# EAGLE schematic schematic_final_pcb (EAGLE 9.7.0)
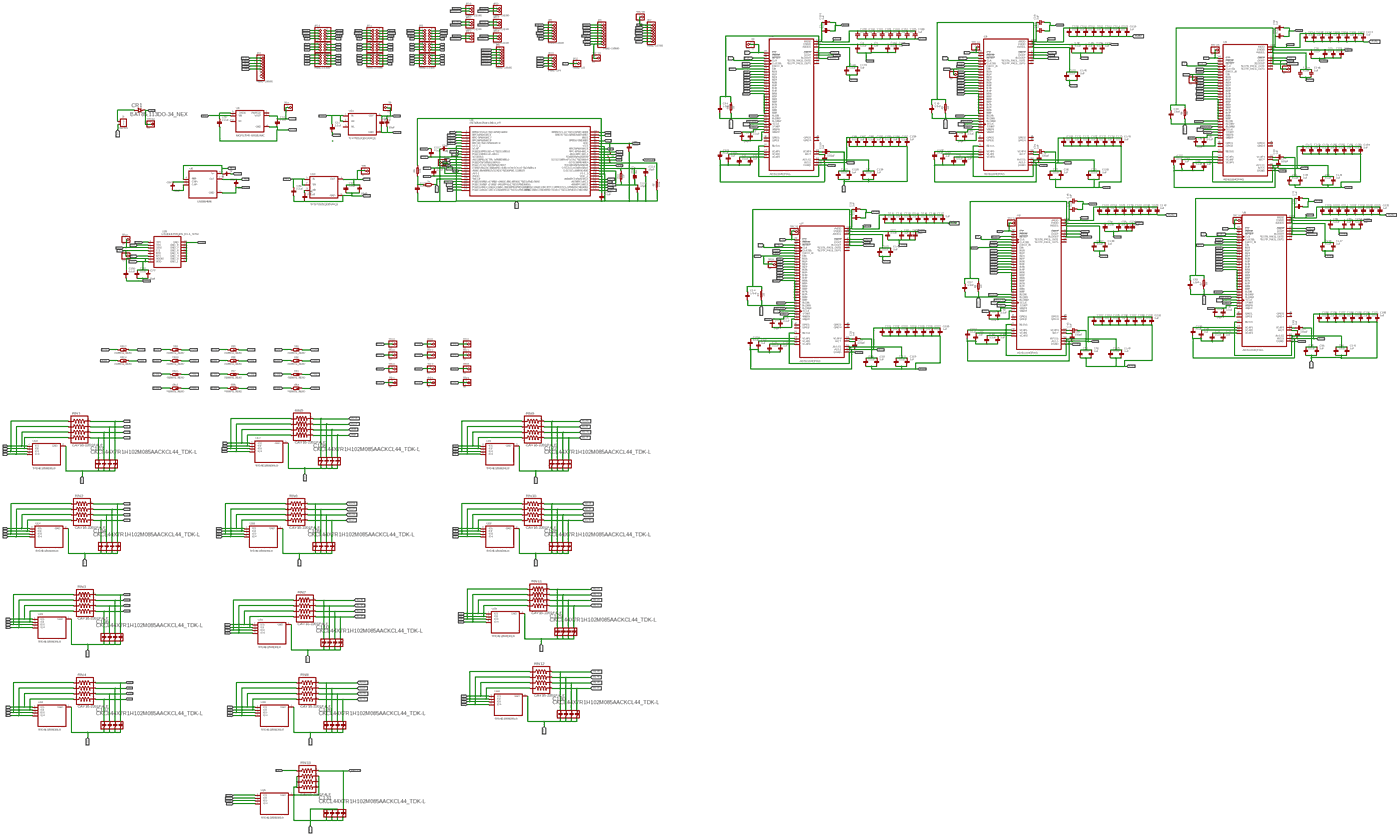
[diagram p0: schematic, sheet 1, overview]
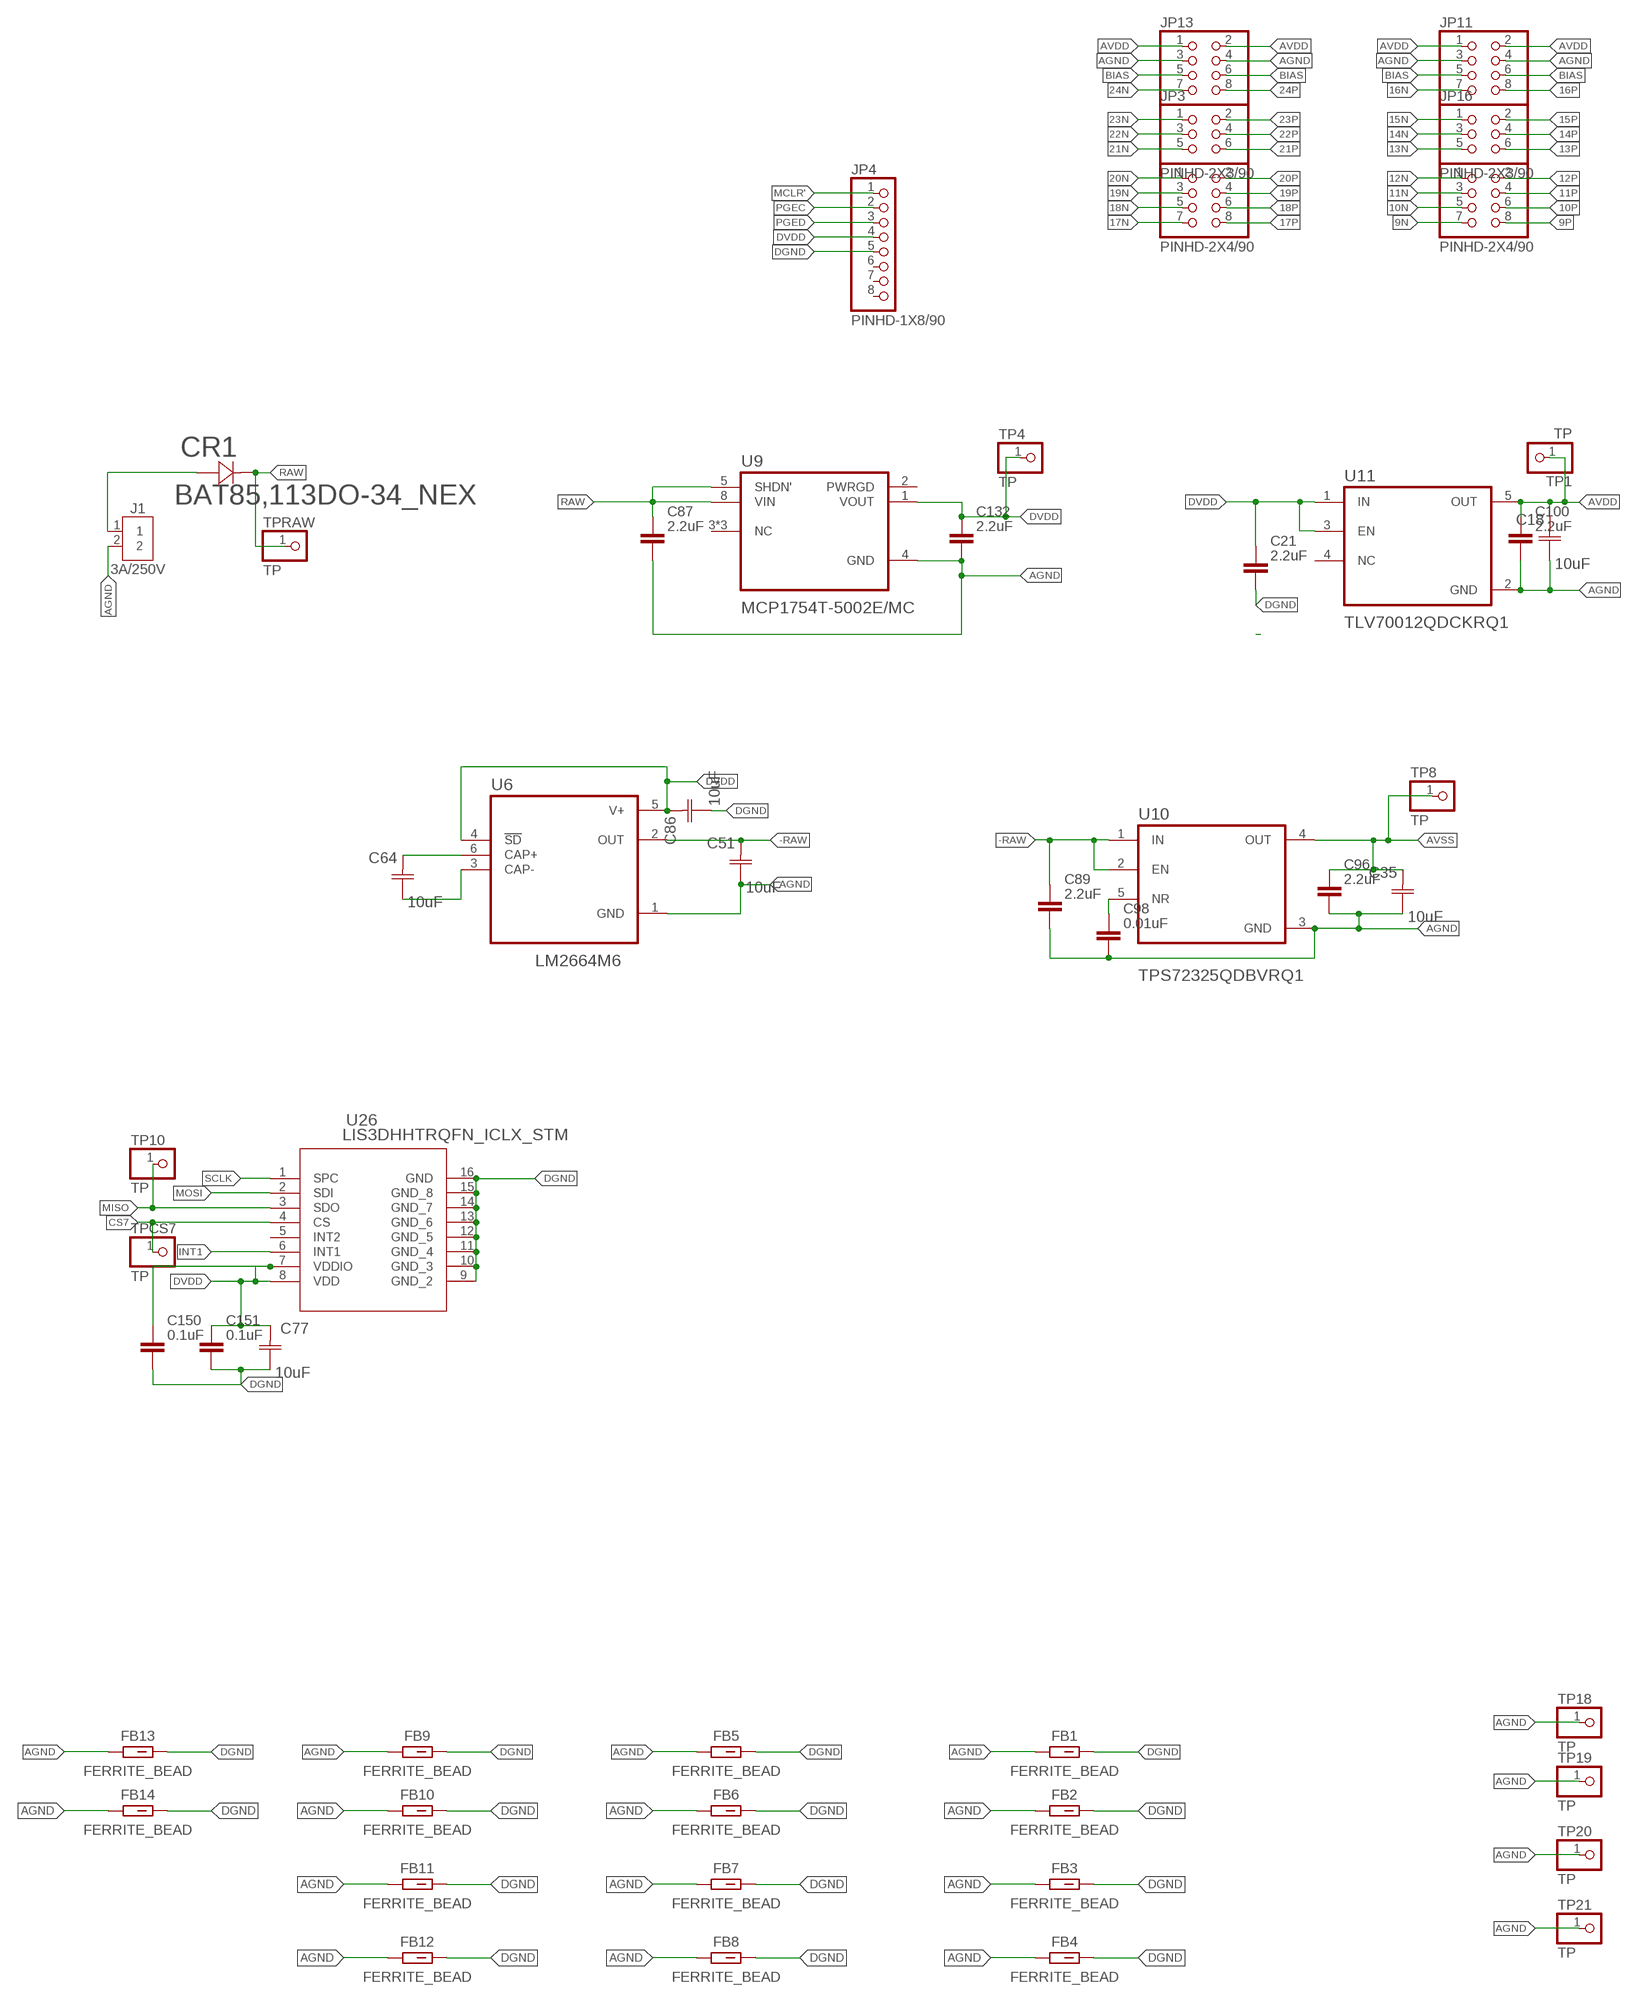
[diagram p1: schematic, sheet 1, part 1 of 6]
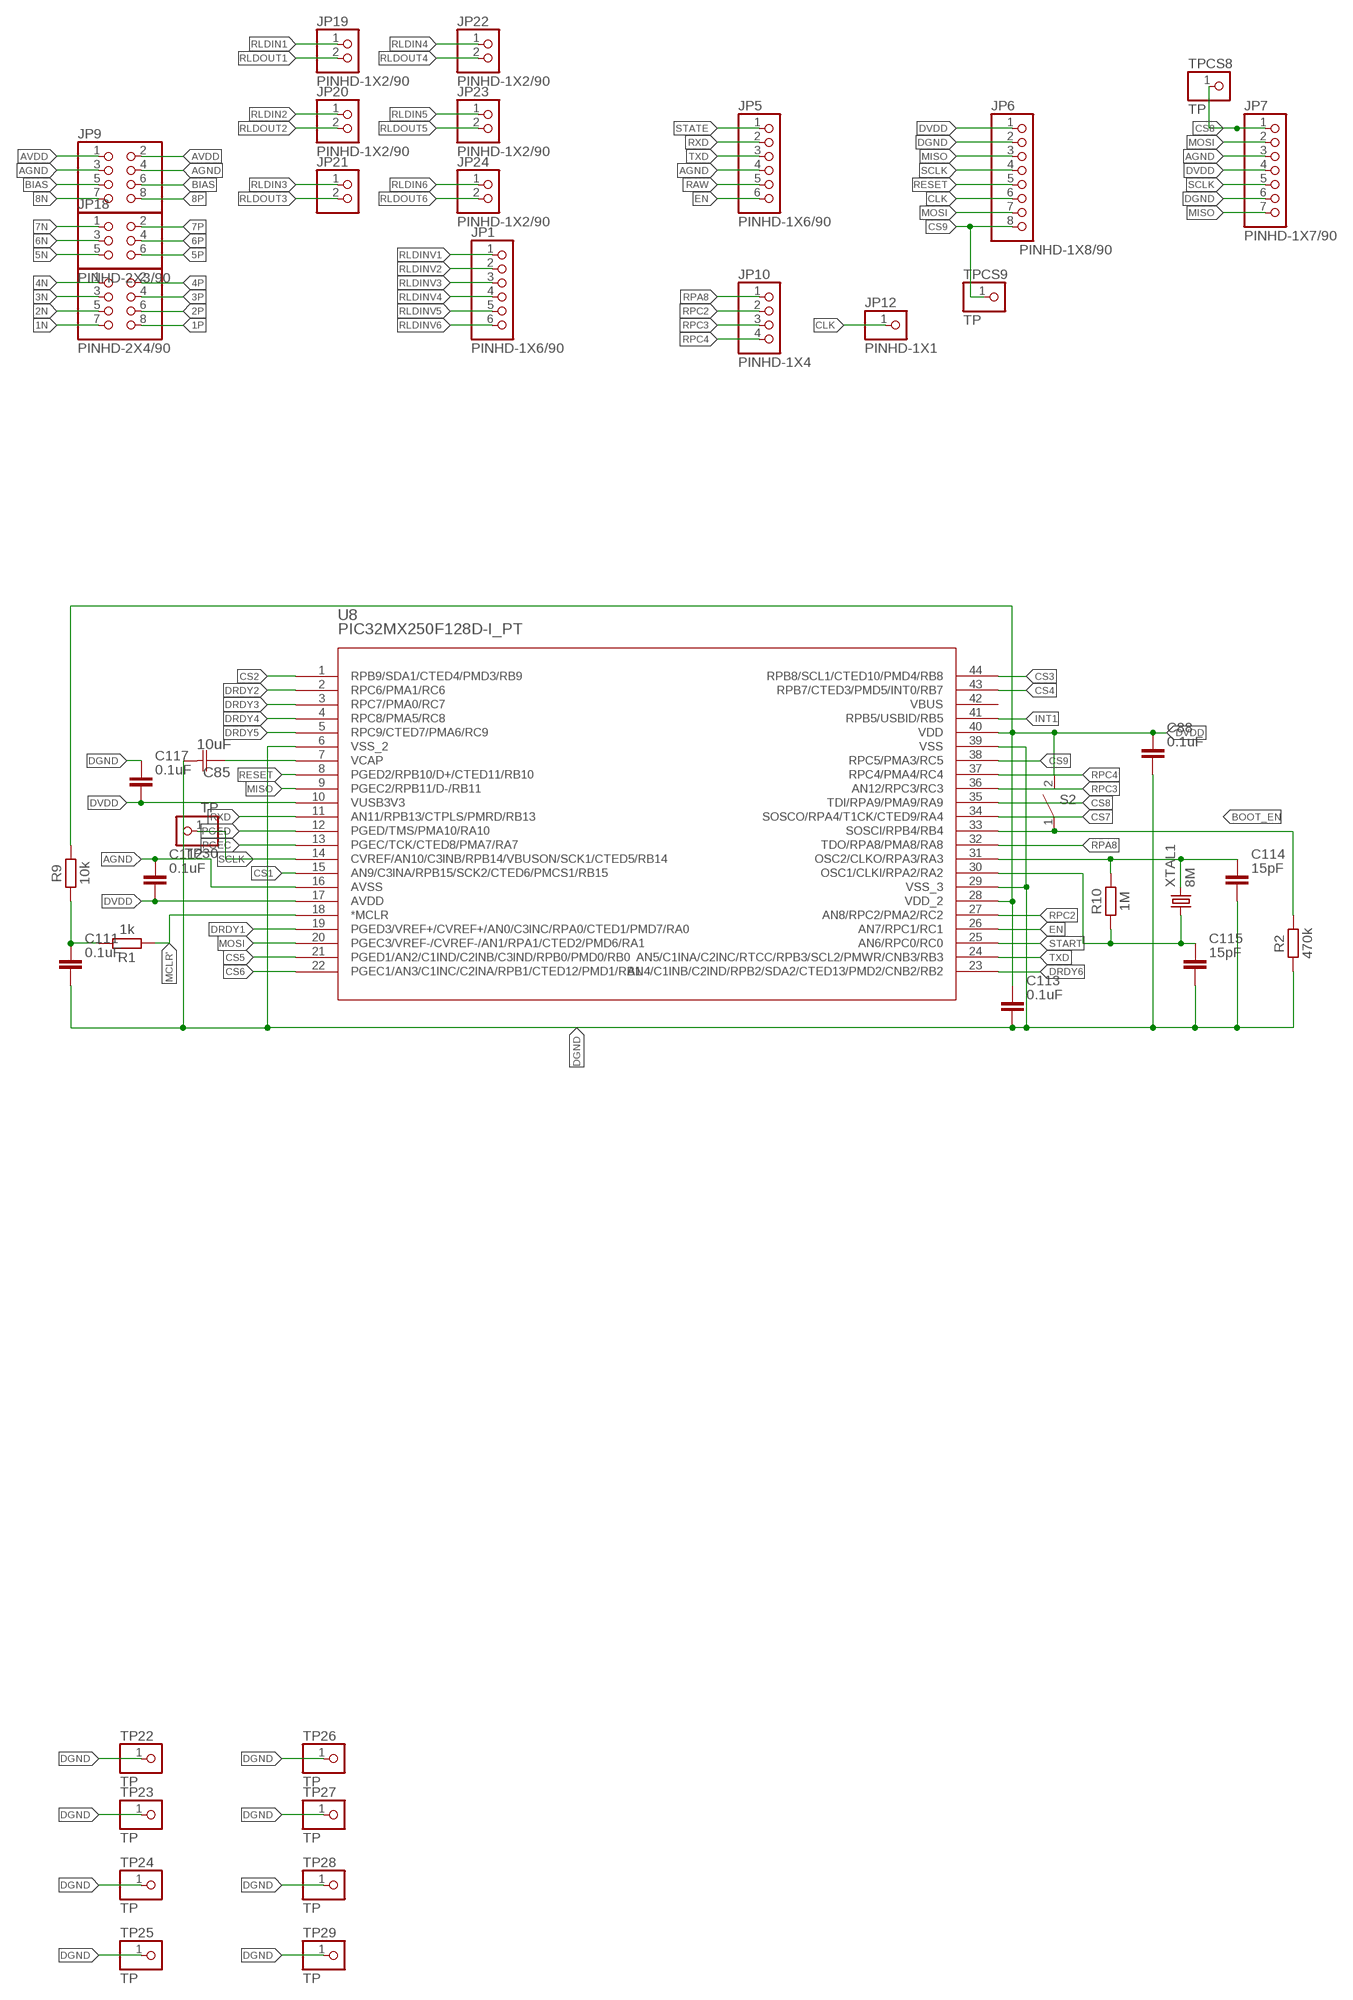
[diagram p2: schematic, sheet 1, part 2 of 6]
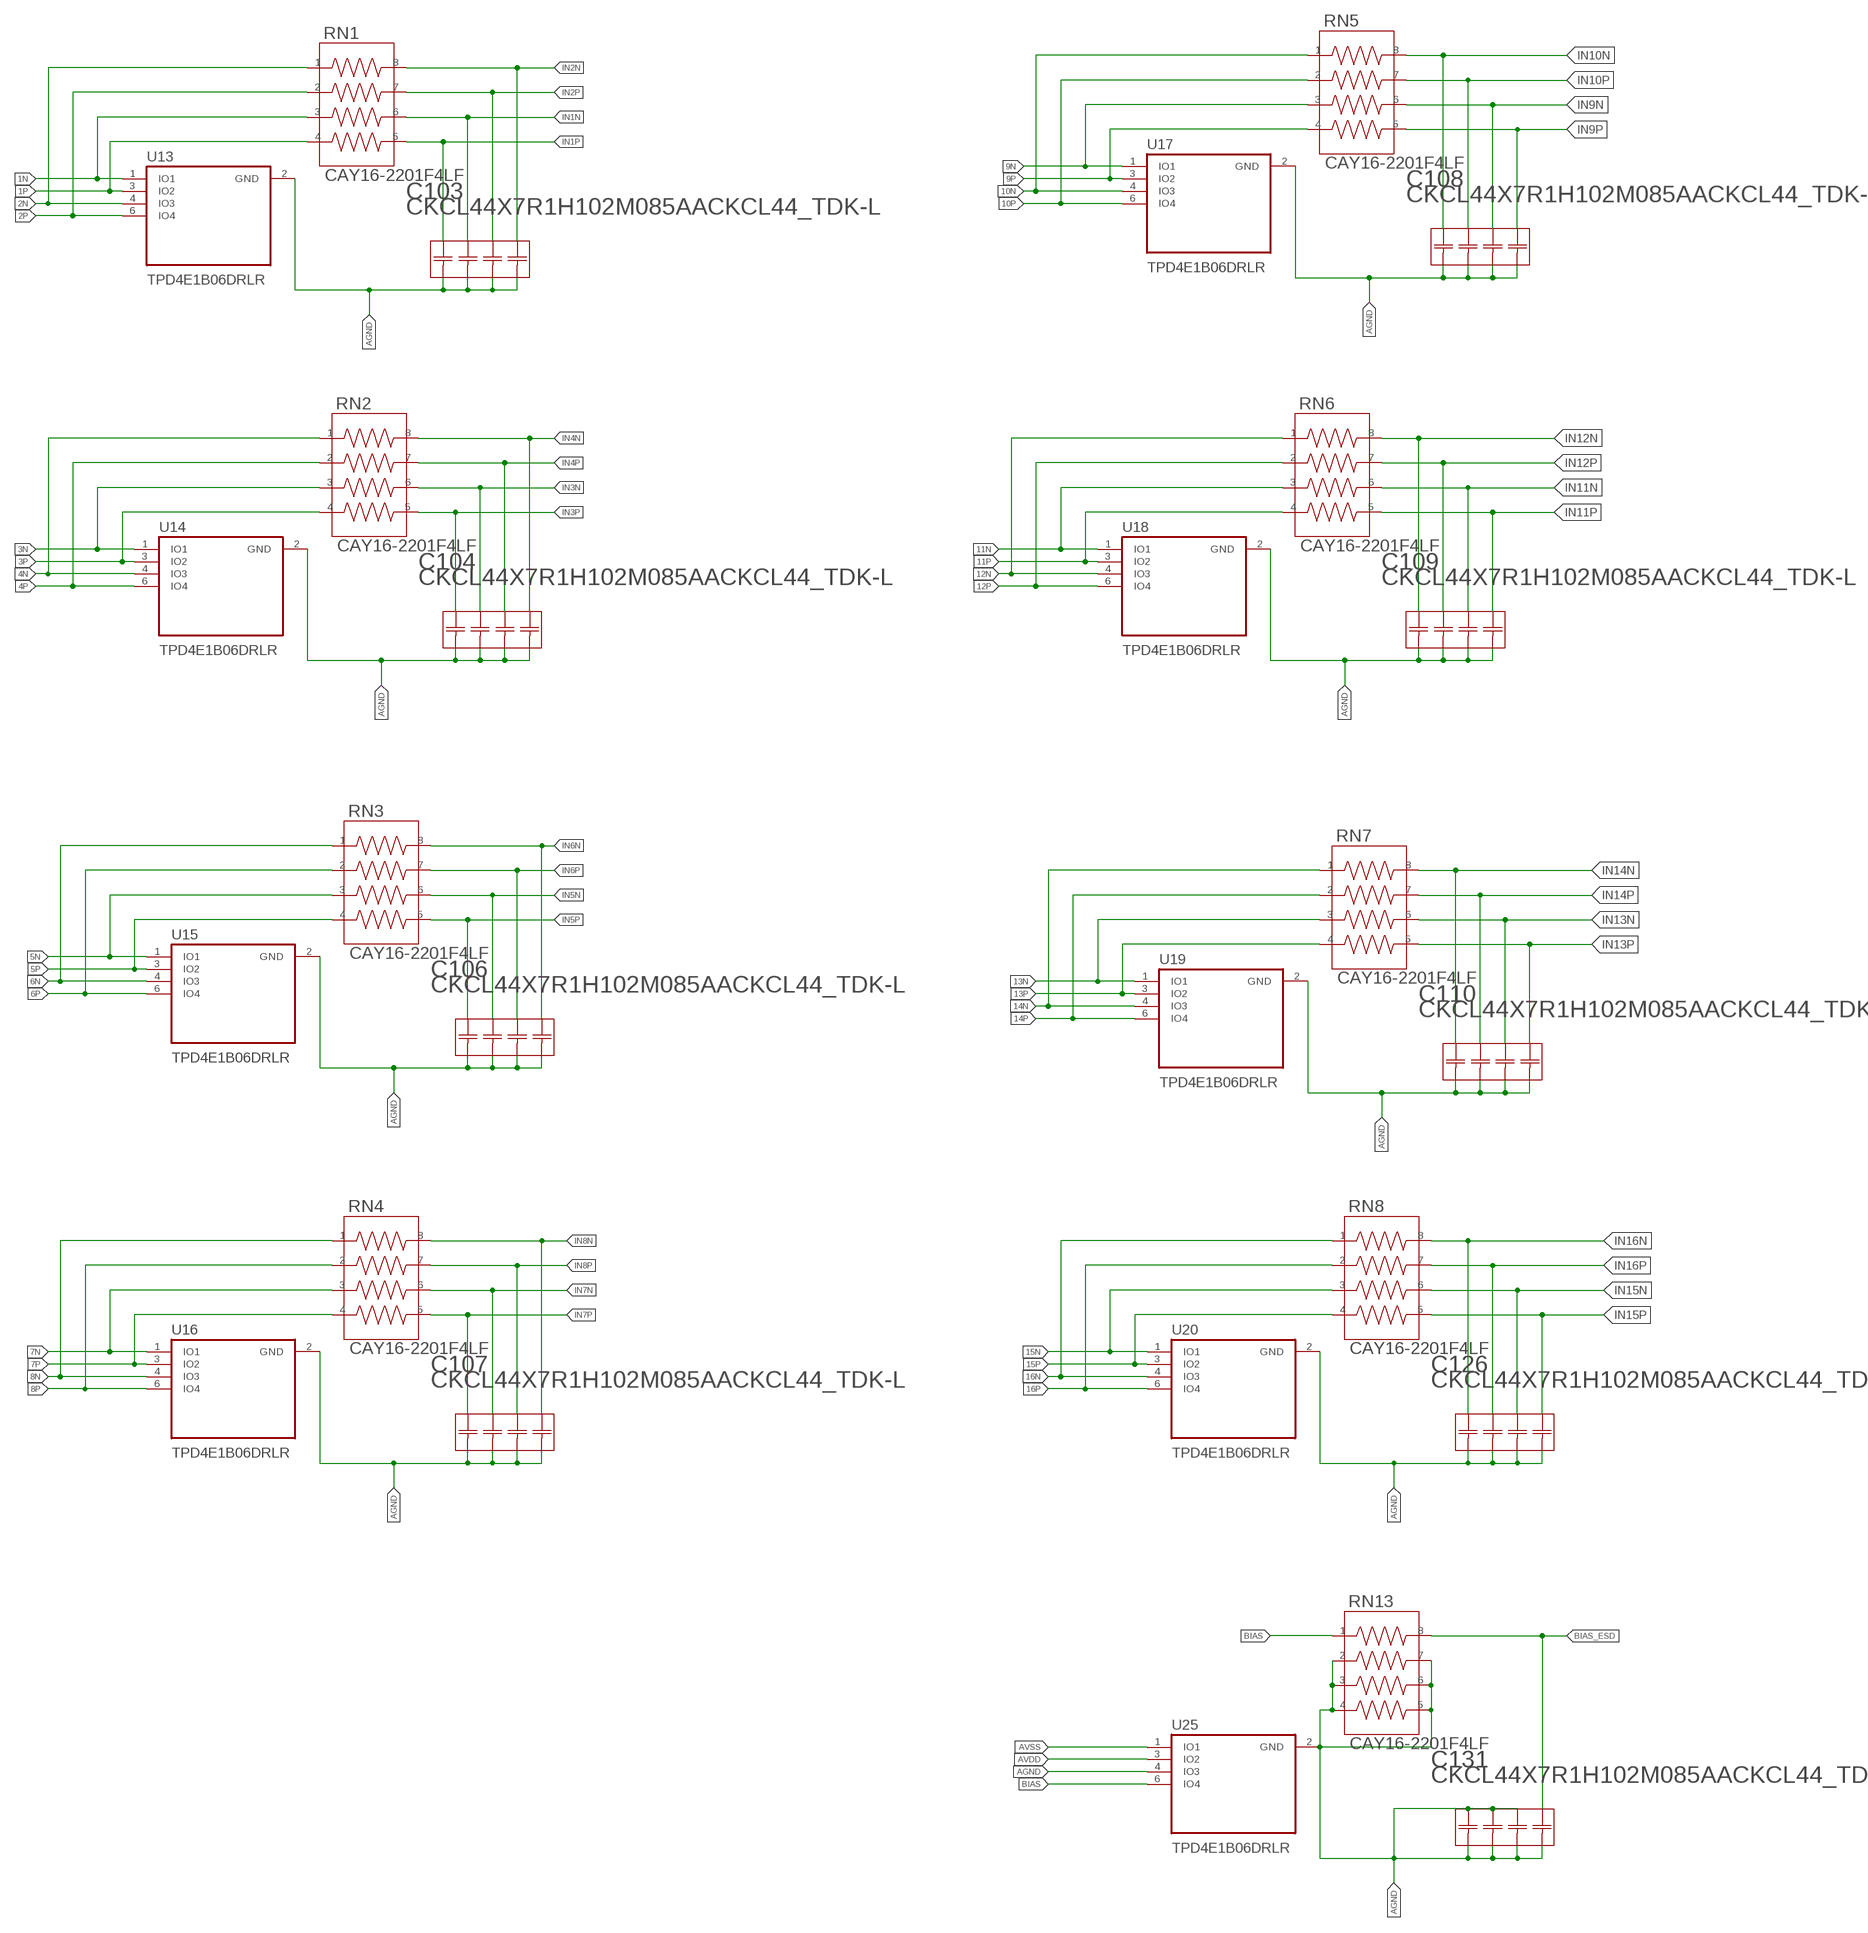
[diagram p3: schematic, sheet 1, part 3 of 6]
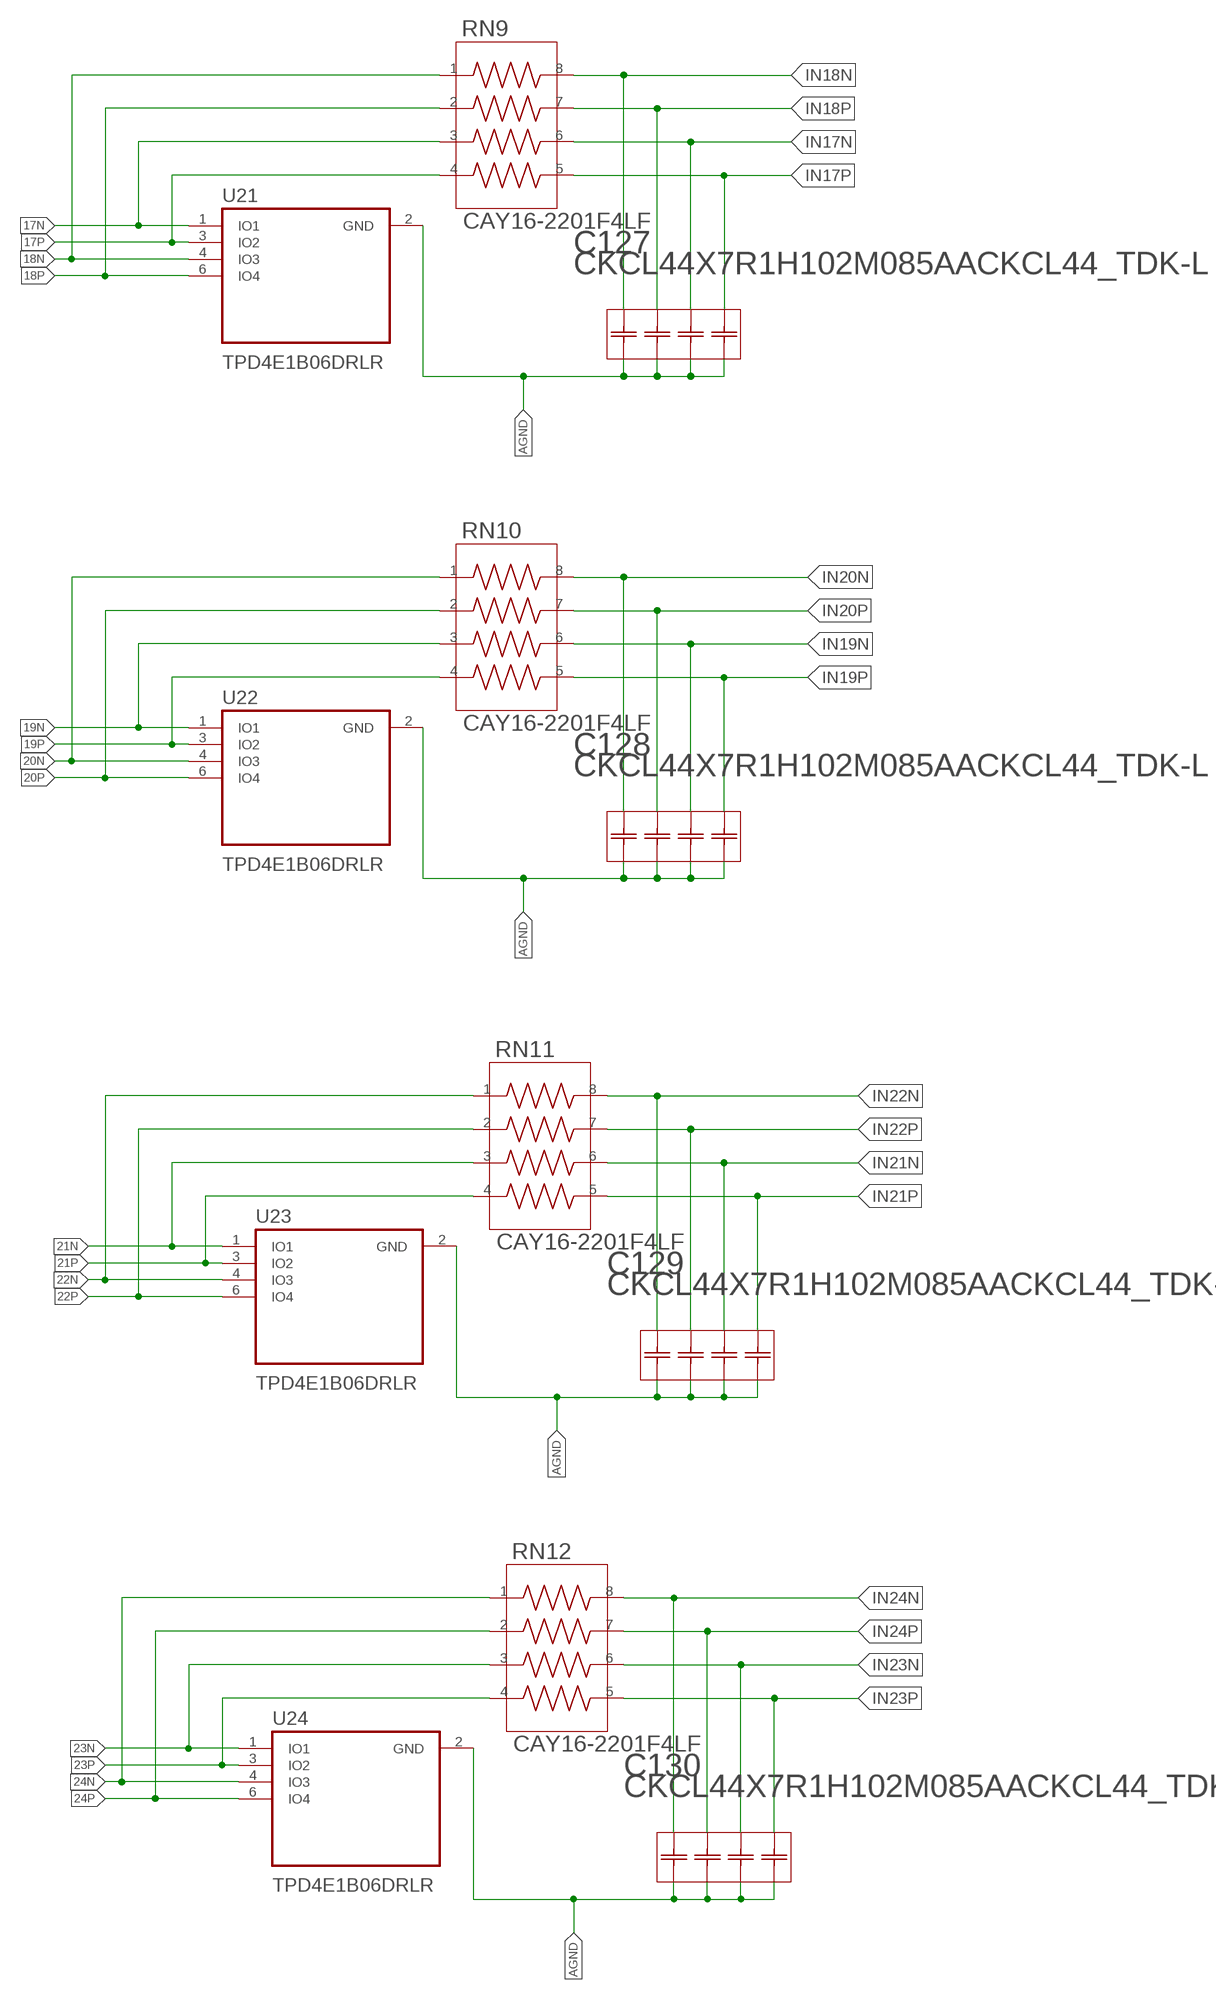
[diagram p4: schematic, sheet 1, part 4 of 6]
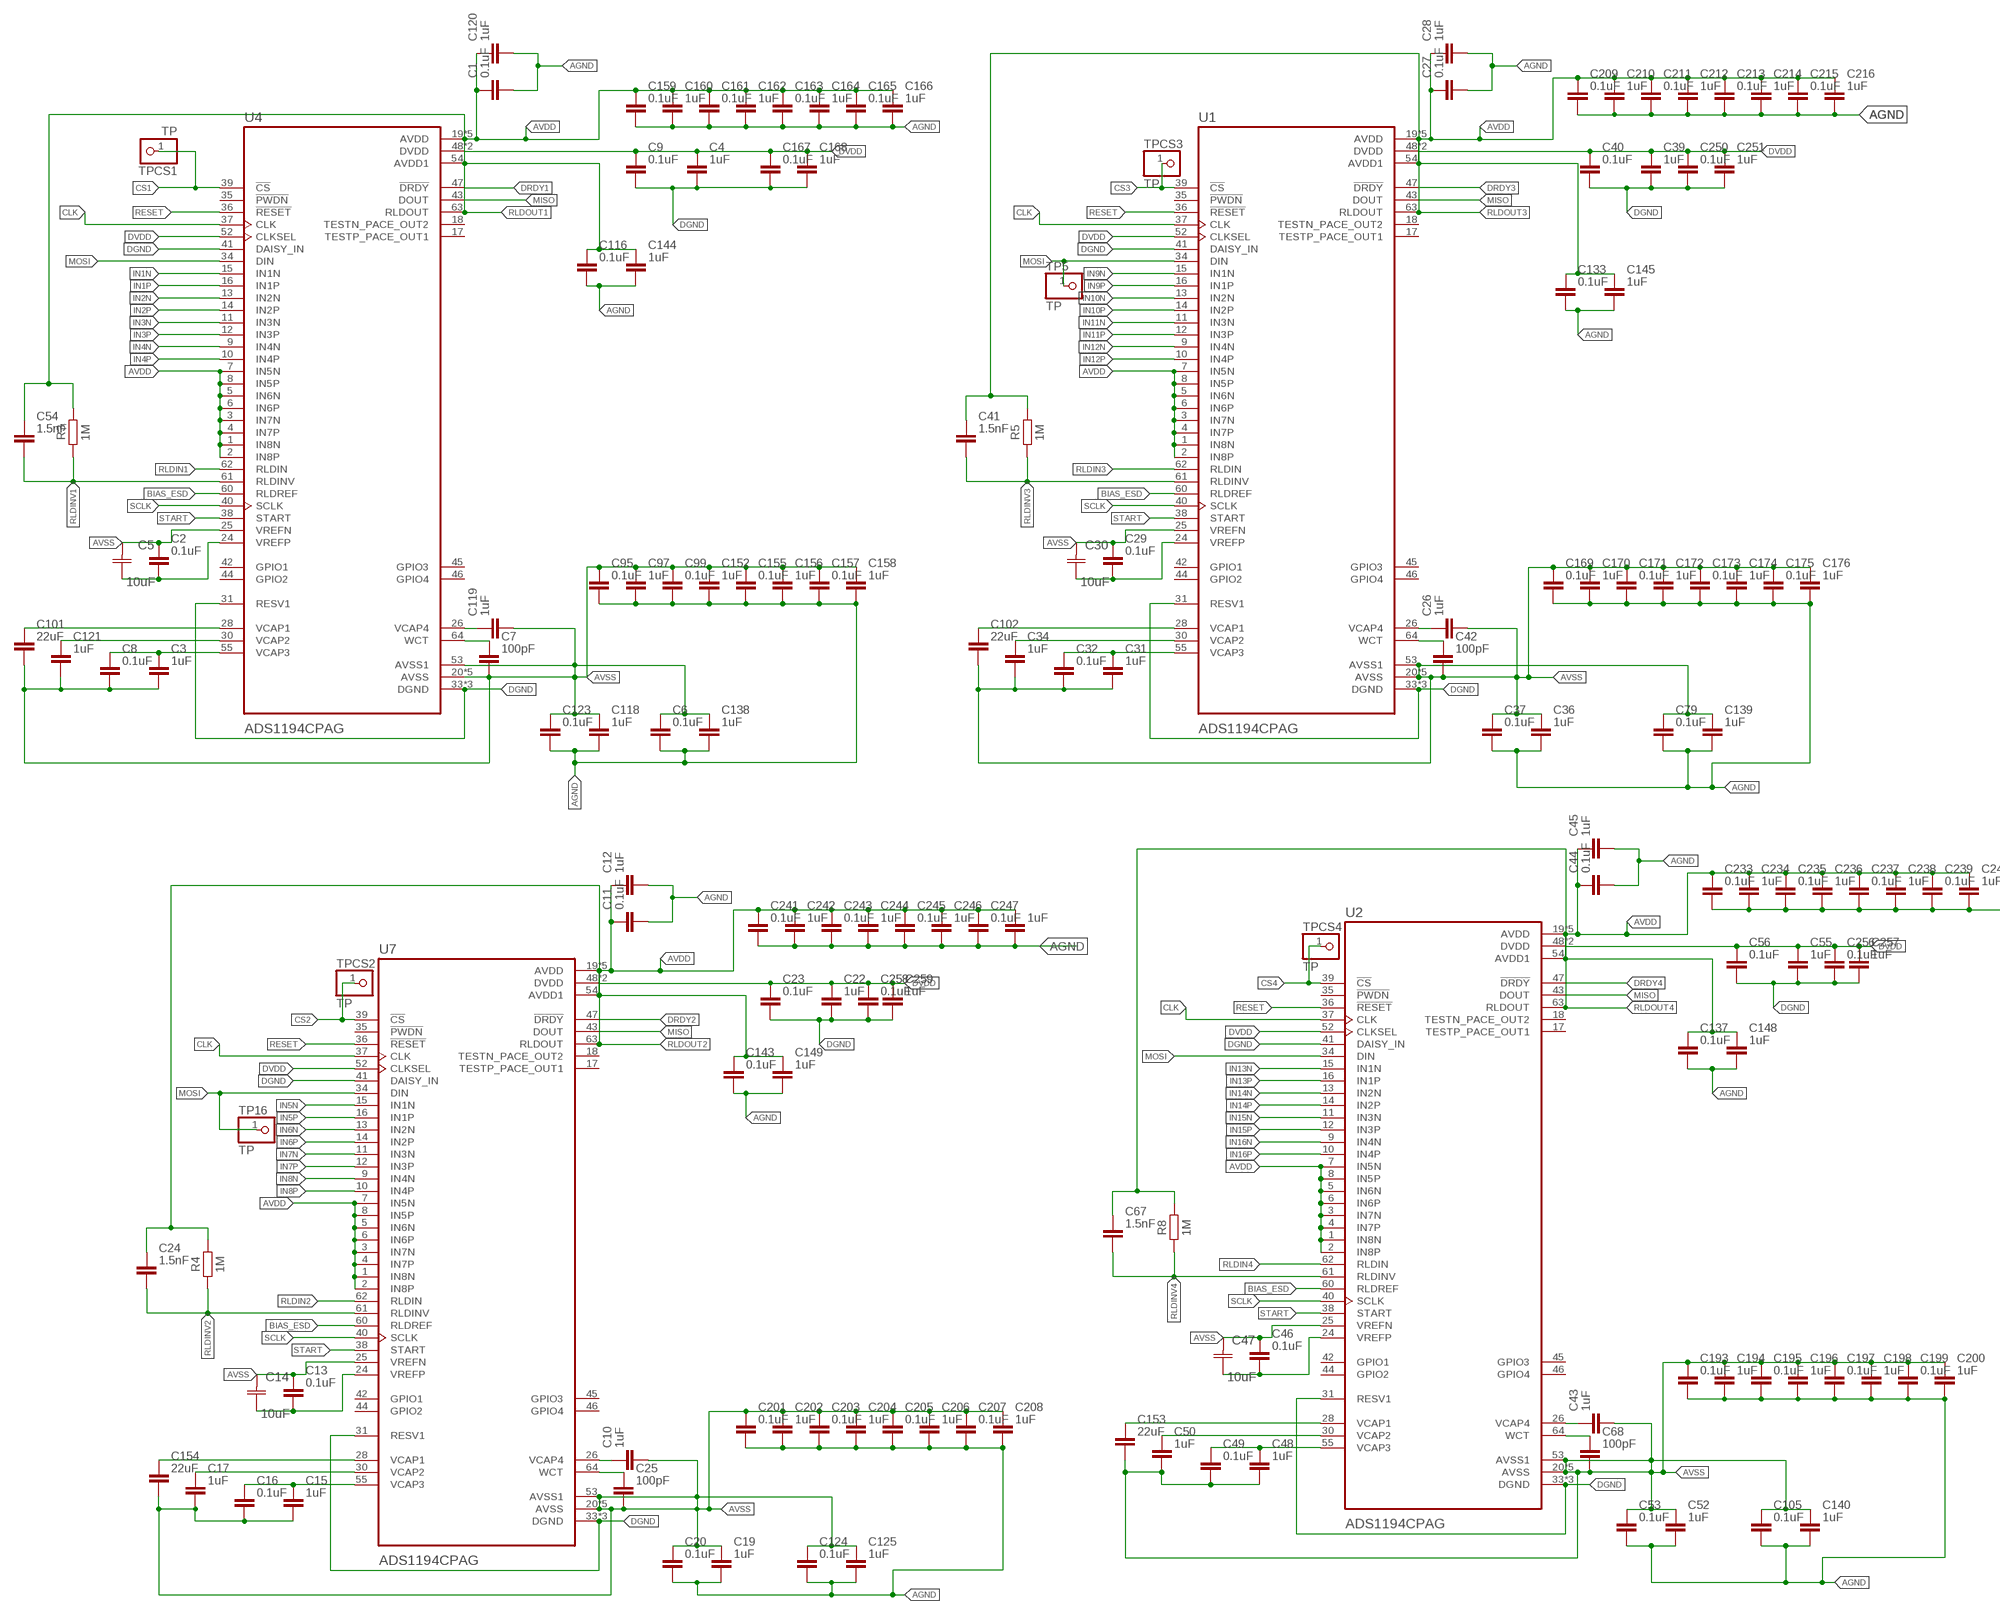
[diagram p5: schematic, sheet 1, part 5 of 6]
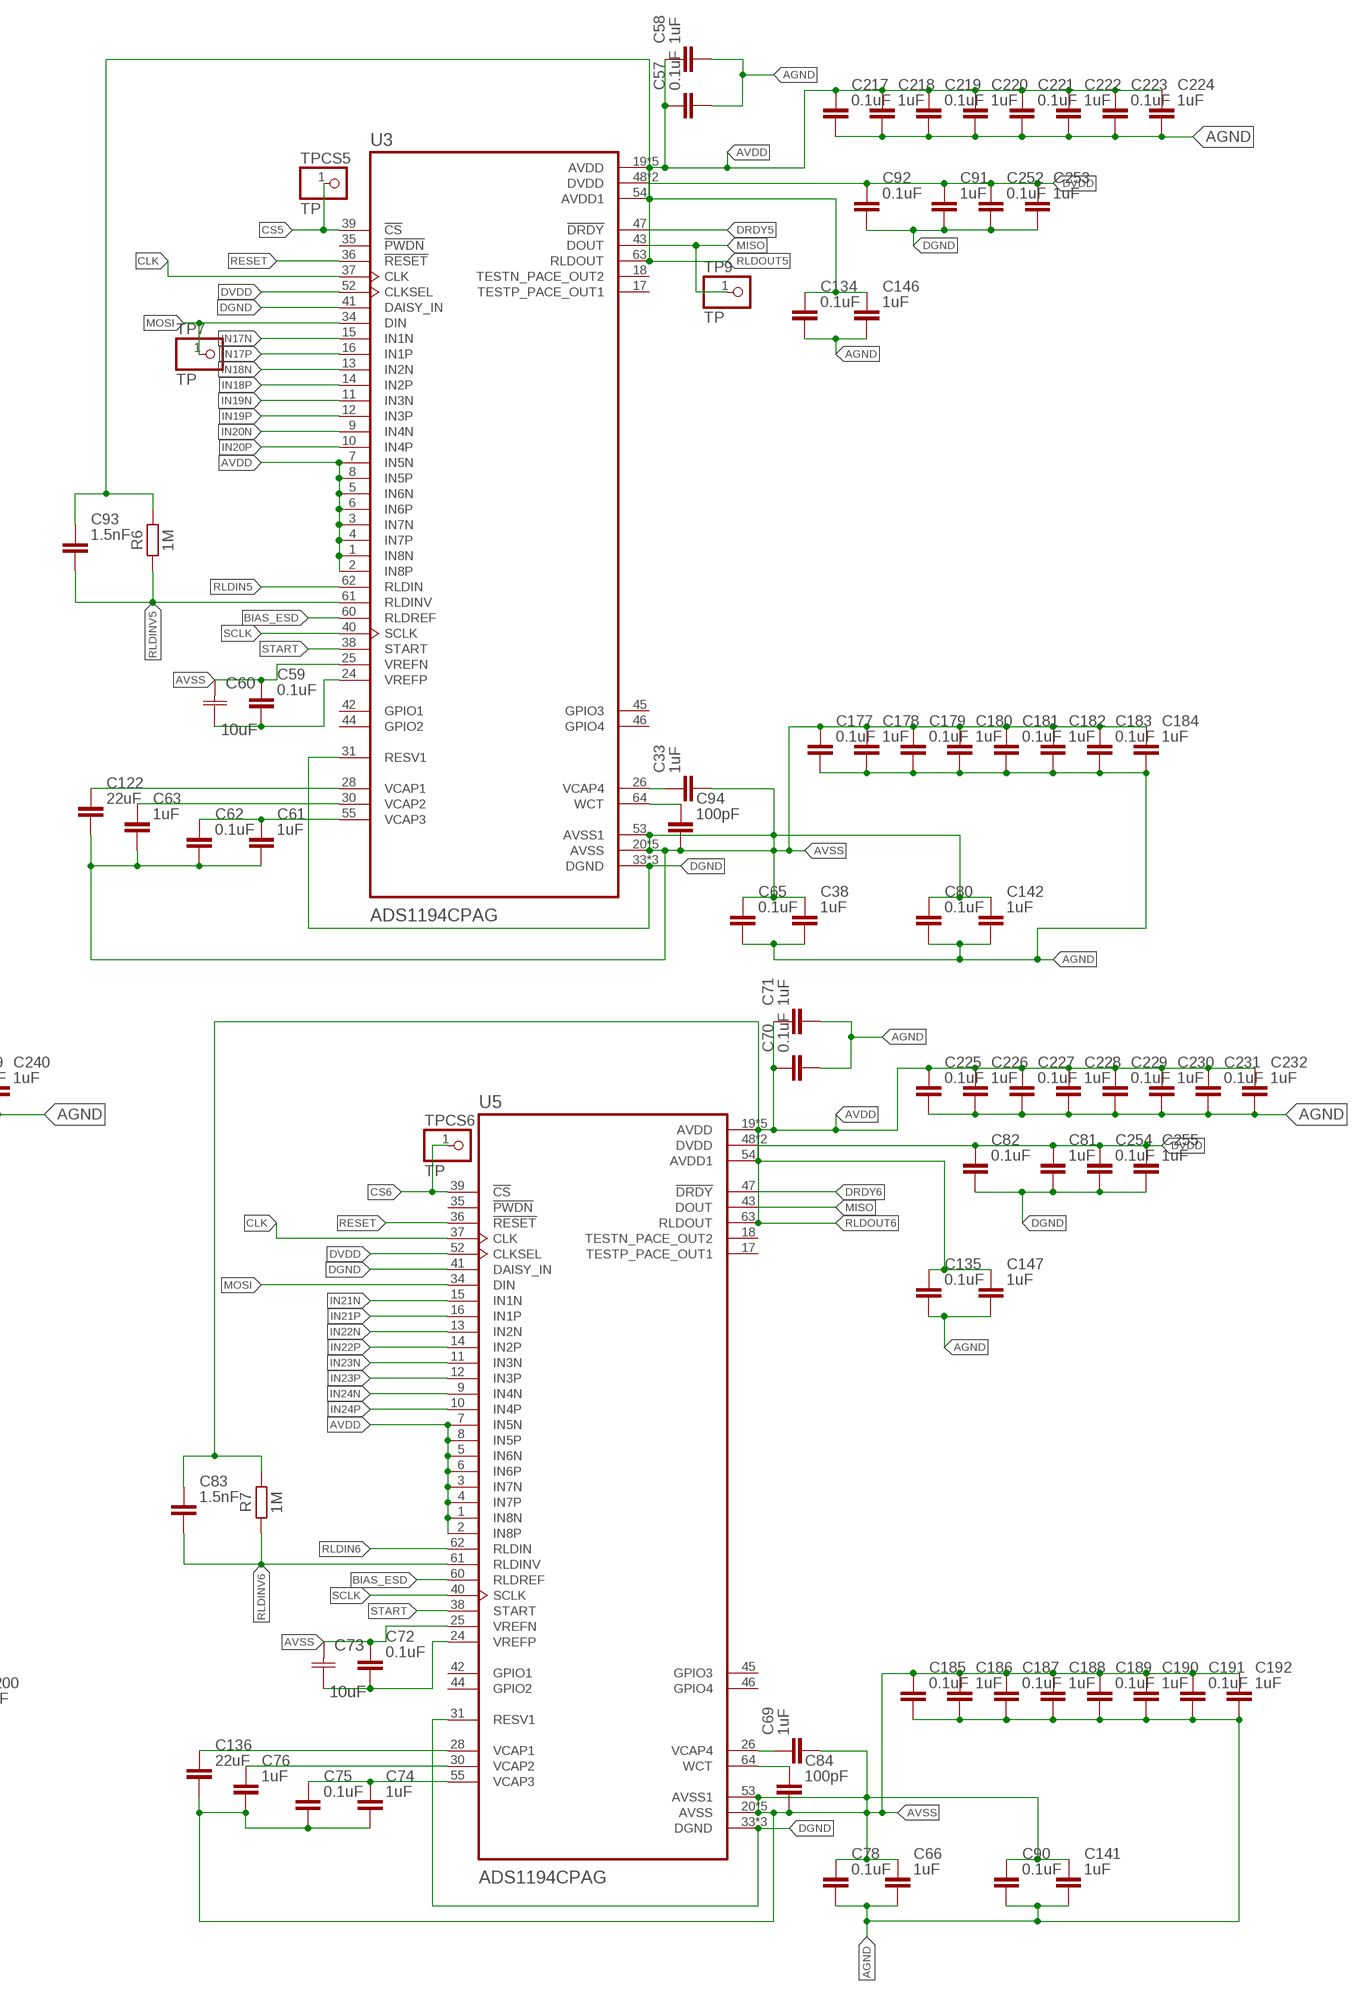
[diagram p6: schematic, sheet 1, part 6 of 6]

## Parts
C1  0.1uF  C_CHIP-0805(2012-METRIC)  [CAPC2012X110]
C2  0.1uF  C_CHIP-0805(2012-METRIC)  [CAPC2012X110]
C3  1uF  C_CHIP-0805(2012-METRIC)  [CAPC2012X110]
C4  1uF  C_CHIP-0805(2012-METRIC)  [CAPC2012X110]
C5  10uF  293D106X0016A2TE3CAP_293D-A_VSS  [CAP_293D-A_VSS]
C6  0.1uF  C_CHIP-0805(2012-METRIC)  [CAPC2012X110]
C7  100pF  C_CHIP-0603(1608-METRIC)  [CAPC1608X85]
C8  0.1uF  C_CHIP-0805(2012-METRIC)  [CAPC2012X110]
C9  0.1uF  C_CHIP-0805(2012-METRIC)  [CAPC2012X110]
C10  1uF  C_CHIP-0805(2012-METRIC)  [CAPC2012X110]
C11  0.1uF  C_CHIP-0805(2012-METRIC)  [CAPC2012X110]
C12  1uF  C_CHIP-0805(2012-METRIC)  [CAPC2012X110]
C13  0.1uF  C_CHIP-0805(2012-METRIC)  [CAPC2012X110]
C14  10uF  293D106X0016A2TE3CAP_293D-A_VSS  [CAP_293D-A_VSS]
C15  1uF  C_CHIP-0805(2012-METRIC)  [CAPC2012X110]
C16  0.1uF  C_CHIP-0805(2012-METRIC)  [CAPC2012X110]
C17  1uF  C_CHIP-0805(2012-METRIC)  [CAPC2012X110]
C18  10uF  293D106X0016A2TE3CAP_293D-A_VSS  [CAP_293D-A_VSS]
C19  1uF  C_CHIP-0805(2012-METRIC)  [CAPC2012X110]
C20  0.1uF  C_CHIP-0805(2012-METRIC)  [CAPC2012X110]
C21  2.2uF  C_CHIP-0603(1608-METRIC)  [CAPC1608X85]
C22  1uF  C_CHIP-0805(2012-METRIC)  [CAPC2012X110]
C23  0.1uF  C_CHIP-0805(2012-METRIC)  [CAPC2012X110]
C24  1.5nF  C_CHIP-0603(1608-METRIC)  [CAPC1608X85]
C25  100pF  C_CHIP-0603(1608-METRIC)  [CAPC1608X85]
C26  1uF  C_CHIP-0805(2012-METRIC)  [CAPC2012X110]
C27  0.1uF  C_CHIP-0805(2012-METRIC)  [CAPC2012X110]
C28  1uF  C_CHIP-0805(2012-METRIC)  [CAPC2012X110]
C29  0.1uF  C_CHIP-0805(2012-METRIC)  [CAPC2012X110]
C30  10uF  293D106X0016A2TE3CAP_293D-A_VSS  [CAP_293D-A_VSS]
C31  1uF  C_CHIP-0805(2012-METRIC)  [CAPC2012X110]
C32  0.1uF  C_CHIP-0805(2012-METRIC)  [CAPC2012X110]
C33  1uF  C_CHIP-0805(2012-METRIC)  [CAPC2012X110]
C34  1uF  C_CHIP-0805(2012-METRIC)  [CAPC2012X110]
C35  10uF  293D106X0016A2TE3CAP_293D-A_VSS  [CAP_293D-A_VSS]
C36  1uF  C_CHIP-0805(2012-METRIC)  [CAPC2012X110]
C37  0.1uF  C_CHIP-0805(2012-METRIC)  [CAPC2012X110]
C38  1uF  C_CHIP-0805(2012-METRIC)  [CAPC2012X110]
C39  1uF  C_CHIP-0805(2012-METRIC)  [CAPC2012X110]
C40  0.1uF  C_CHIP-0805(2012-METRIC)  [CAPC2012X110]
C41  1.5nF  C_CHIP-0603(1608-METRIC)  [CAPC1608X85]
C42  100pF  C_CHIP-0603(1608-METRIC)  [CAPC1608X85]
C43  1uF  C_CHIP-0805(2012-METRIC)  [CAPC2012X110]
C44  0.1uF  C_CHIP-0805(2012-METRIC)  [CAPC2012X110]
C45  1uF  C_CHIP-0805(2012-METRIC)  [CAPC2012X110]
C46  0.1uF  C_CHIP-0805(2012-METRIC)  [CAPC2012X110]
C47  10uF  293D106X0016A2TE3CAP_293D-A_VSS  [CAP_293D-A_VSS]
C48  1uF  C_CHIP-0805(2012-METRIC)  [CAPC2012X110]
C49  0.1uF  C_CHIP-0805(2012-METRIC)  [CAPC2012X110]
C50  1uF  C_CHIP-0805(2012-METRIC)  [CAPC2012X110]
C51  10uF  293D106X0016A2TE3CAP_293D-A_VSS  [CAP_293D-A_VSS]
C52  1uF  C_CHIP-0805(2012-METRIC)  [CAPC2012X110]
C53  0.1uF  C_CHIP-0805(2012-METRIC)  [CAPC2012X110]
C54  1.5nF  C_CHIP-0603(1608-METRIC)  [CAPC1608X85]
C55  1uF  C_CHIP-0805(2012-METRIC)  [CAPC2012X110]
C56  0.1uF  C_CHIP-0805(2012-METRIC)  [CAPC2012X110]
C57  0.1uF  C_CHIP-0805(2012-METRIC)  [CAPC2012X110]
C58  1uF  C_CHIP-0805(2012-METRIC)  [CAPC2012X110]
C59  0.1uF  C_CHIP-0805(2012-METRIC)  [CAPC2012X110]
C60  10uF  293D106X0016A2TE3CAP_293D-A_VSS  [CAP_293D-A_VSS]
C61  1uF  C_CHIP-0805(2012-METRIC)  [CAPC2012X110]
C62  0.1uF  C_CHIP-0805(2012-METRIC)  [CAPC2012X110]
C63  1uF  C_CHIP-0805(2012-METRIC)  [CAPC2012X110]
C64  10uF  293D106X0016A2TE3CAP_293D-A_VSS  [CAP_293D-A_VSS]
C65  0.1uF  C_CHIP-0805(2012-METRIC)  [CAPC2012X110]
C66  1uF  C_CHIP-0805(2012-METRIC)  [CAPC2012X110]
C67  1.5nF  C_CHIP-0603(1608-METRIC)  [CAPC1608X85]
C68  100pF  C_CHIP-0603(1608-METRIC)  [CAPC1608X85]
C69  1uF  C_CHIP-0805(2012-METRIC)  [CAPC2012X110]
C70  0.1uF  C_CHIP-0805(2012-METRIC)  [CAPC2012X110]
C71  1uF  C_CHIP-0805(2012-METRIC)  [CAPC2012X110]
C72  0.1uF  C_CHIP-0805(2012-METRIC)  [CAPC2012X110]
C73  10uF  293D106X0016A2TE3CAP_293D-A_VSS  [CAP_293D-A_VSS]
C74  1uF  C_CHIP-0805(2012-METRIC)  [CAPC2012X110]
C75  0.1uF  C_CHIP-0805(2012-METRIC)  [CAPC2012X110]
C76  1uF  C_CHIP-0805(2012-METRIC)  [CAPC2012X110]
C77  10uF  293D106X0016A2TE3CAP_293D-A_VSS  [CAP_293D-A_VSS]
C78  0.1uF  C_CHIP-0805(2012-METRIC)  [CAPC2012X110]
C79  0.1uF  C_CHIP-0805(2012-METRIC)  [CAPC2012X110]
C80  0.1uF  C_CHIP-0805(2012-METRIC)  [CAPC2012X110]
C81  1uF  C_CHIP-0805(2012-METRIC)  [CAPC2012X110]
C82  0.1uF  C_CHIP-0805(2012-METRIC)  [CAPC2012X110]
C83  1.5nF  C_CHIP-0603(1608-METRIC)  [CAPC1608X85]
C84  100pF  C_CHIP-0603(1608-METRIC)  [CAPC1608X85]
C85  10uF  293D106X0016A2TE3CAP_293D-A_VSS  [CAP_293D-A_VSS]
C86  10uF  293D106X0016A2TE3CAP_293D-A_VSS  [CAP_293D-A_VSS]
C87  2.2uF  C_CHIP-0603(1608-METRIC)  [CAPC1608X85]
C88  0.1uF  C_CHIP-0805(2012-METRIC)  [CAPC2012X110]
C89  2.2uF  C_CHIP-0603(1608-METRIC)  [CAPC1608X85]
C90  0.1uF  C_CHIP-0805(2012-METRIC)  [CAPC2012X110]
C91  1uF  C_CHIP-0805(2012-METRIC)  [CAPC2012X110]
C92  0.1uF  C_CHIP-0805(2012-METRIC)  [CAPC2012X110]
C93  1.5nF  C_CHIP-0603(1608-METRIC)  [CAPC1608X85]
C94  100pF  C_CHIP-0603(1608-METRIC)  [CAPC1608X85]
C95  0.1uF  C_CHIP-0805(2012-METRIC)  [CAPC2012X110]
C96  2.2uF  C_CHIP-0603(1608-METRIC)  [CAPC1608X85]
C97  1uF  C_CHIP-0805(2012-METRIC)  [CAPC2012X110]
C98  0.01uF  C_CHIP-0805(2012-METRIC)  [CAPC2012X110]
C99  0.1uF  C_CHIP-0805(2012-METRIC)  [CAPC2012X110]
C100  2.2uF  C_CHIP-0603(1608-METRIC)  [CAPC1608X85]
C101  22uF  C_TANTALUM-1206(3216-METRIC)  [CAPM3216X180]
C102  22uF  C_TANTALUM-1206(3216-METRIC)  [CAPM3216X180]
C103  CKCL44X7R1H102M085AACKCL44_TDK-L  [CKCL44_TDK-L]
C104  CKCL44X7R1H102M085AACKCL44_TDK-L  [CKCL44_TDK-L]
C105  0.1uF  C_CHIP-0805(2012-METRIC)  [CAPC2012X110]
C106  CKCL44X7R1H102M085AACKCL44_TDK-L  [CKCL44_TDK-L]
C107  CKCL44X7R1H102M085AACKCL44_TDK-L  [CKCL44_TDK-L]
C108  CKCL44X7R1H102M085AACKCL44_TDK-L  [CKCL44_TDK-L]
C109  CKCL44X7R1H102M085AACKCL44_TDK-L  [CKCL44_TDK-L]
C110  CKCL44X7R1H102M085AACKCL44_TDK-L  [CKCL44_TDK-L]
C111  0.1uF  C_CHIP-0805(2012-METRIC)  [CAPC2012X110]
C112  0.1uF  C_CHIP-0805(2012-METRIC)  [CAPC2012X110]
C113  0.1uF  C_CHIP-0805(2012-METRIC)  [CAPC2012X110]
C114  15pF  C_CHIP-0603(1608-METRIC)  [CAPC1608X85]
C115  15pF  C_CHIP-0603(1608-METRIC)  [CAPC1608X85]
C116  0.1uF  C_CHIP-0805(2012-METRIC)  [CAPC2012X110]
C117  0.1uF  C_CHIP-0805(2012-METRIC)  [CAPC2012X110]
C118  1uF  C_CHIP-0805(2012-METRIC)  [CAPC2012X110]
C119  1uF  C_CHIP-0805(2012-METRIC)  [CAPC2012X110]
C120  1uF  C_CHIP-0805(2012-METRIC)  [CAPC2012X110]
C121  1uF  C_CHIP-0805(2012-METRIC)  [CAPC2012X110]
C122  22uF  C_TANTALUM-1206(3216-METRIC)  [CAPM3216X180]
C123  0.1uF  C_CHIP-0805(2012-METRIC)  [CAPC2012X110]
C124  0.1uF  C_CHIP-0805(2012-METRIC)  [CAPC2012X110]
C125  1uF  C_CHIP-0805(2012-METRIC)  [CAPC2012X110]
C126  CKCL44X7R1H102M085AACKCL44_TDK-L  [CKCL44_TDK-L]
C127  CKCL44X7R1H102M085AACKCL44_TDK-L  [CKCL44_TDK-L]
C128  CKCL44X7R1H102M085AACKCL44_TDK-L  [CKCL44_TDK-L]
C129  CKCL44X7R1H102M085AACKCL44_TDK-L  [CKCL44_TDK-L]
C130  CKCL44X7R1H102M085AACKCL44_TDK-L  [CKCL44_TDK-L]
C131  CKCL44X7R1H102M085AACKCL44_TDK-L  [CKCL44_TDK-L]
C132  2.2uF  C_CHIP-0603(1608-METRIC)  [CAPC1608X85]
C133  0.1uF  C_CHIP-0805(2012-METRIC)  [CAPC2012X110]
C134  0.1uF  C_CHIP-0805(2012-METRIC)  [CAPC2012X110]
C135  0.1uF  C_CHIP-0805(2012-METRIC)  [CAPC2012X110]
C136  22uF  C_TANTALUM-1206(3216-METRIC)  [CAPM3216X180]
C137  0.1uF  C_CHIP-0805(2012-METRIC)  [CAPC2012X110]
C138  1uF  C_CHIP-0805(2012-METRIC)  [CAPC2012X110]
C139  1uF  C_CHIP-0805(2012-METRIC)  [CAPC2012X110]
C140  1uF  C_CHIP-0805(2012-METRIC)  [CAPC2012X110]
C141  1uF  C_CHIP-0805(2012-METRIC)  [CAPC2012X110]
C142  1uF  C_CHIP-0805(2012-METRIC)  [CAPC2012X110]
C143  0.1uF  C_CHIP-0805(2012-METRIC)  [CAPC2012X110]
C144  1uF  C_CHIP-0805(2012-METRIC)  [CAPC2012X110]
C145  1uF  C_CHIP-0805(2012-METRIC)  [CAPC2012X110]
C146  1uF  C_CHIP-0805(2012-METRIC)  [CAPC2012X110]
C147  1uF  C_CHIP-0805(2012-METRIC)  [CAPC2012X110]
C148  1uF  C_CHIP-0805(2012-METRIC)  [CAPC2012X110]
C149  1uF  C_CHIP-0805(2012-METRIC)  [CAPC2012X110]
C150  0.1uF  C_CHIP-0805(2012-METRIC)  [CAPC2012X110]
C151  0.1uF  C_CHIP-0805(2012-METRIC)  [CAPC2012X110]
C152  1uF  C_CHIP-0805(2012-METRIC)  [CAPC2012X110]
C153  22uF  C_TANTALUM-1206(3216-METRIC)  [CAPM3216X180]
C154  22uF  C_TANTALUM-1206(3216-METRIC)  [CAPM3216X180]
C155  0.1uF  C_CHIP-0805(2012-METRIC)  [CAPC2012X110]
C156  1uF  C_CHIP-0805(2012-METRIC)  [CAPC2012X110]
C157  0.1uF  C_CHIP-0805(2012-METRIC)  [CAPC2012X110]
C158  1uF  C_CHIP-0805(2012-METRIC)  [CAPC2012X110]
C159  0.1uF  C_CHIP-0805(2012-METRIC)  [CAPC2012X110]
C160  1uF  C_CHIP-0805(2012-METRIC)  [CAPC2012X110]
C161  0.1uF  C_CHIP-0805(2012-METRIC)  [CAPC2012X110]
C162  1uF  C_CHIP-0805(2012-METRIC)  [CAPC2012X110]
C163  0.1uF  C_CHIP-0805(2012-METRIC)  [CAPC2012X110]
C164  1uF  C_CHIP-0805(2012-METRIC)  [CAPC2012X110]
C165  0.1uF  C_CHIP-0805(2012-METRIC)  [CAPC2012X110]
C166  1uF  C_CHIP-0805(2012-METRIC)  [CAPC2012X110]
C167  0.1uF  C_CHIP-0805(2012-METRIC)  [CAPC2012X110]
C168  1uF  C_CHIP-0805(2012-METRIC)  [CAPC2012X110]
C169  0.1uF  C_CHIP-0805(2012-METRIC)  [CAPC2012X110]
C170  1uF  C_CHIP-0805(2012-METRIC)  [CAPC2012X110]
C171  0.1uF  C_CHIP-0805(2012-METRIC)  [CAPC2012X110]
C172  1uF  C_CHIP-0805(2012-METRIC)  [CAPC2012X110]
C173  0.1uF  C_CHIP-0805(2012-METRIC)  [CAPC2012X110]
C174  1uF  C_CHIP-0805(2012-METRIC)  [CAPC2012X110]
C175  0.1uF  C_CHIP-0805(2012-METRIC)  [CAPC2012X110]
C176  1uF  C_CHIP-0805(2012-METRIC)  [CAPC2012X110]
C177  0.1uF  C_CHIP-0805(2012-METRIC)  [CAPC2012X110]
C178  1uF  C_CHIP-0805(2012-METRIC)  [CAPC2012X110]
C179  0.1uF  C_CHIP-0805(2012-METRIC)  [CAPC2012X110]
C180  1uF  C_CHIP-0805(2012-METRIC)  [CAPC2012X110]
C181  0.1uF  C_CHIP-0805(2012-METRIC)  [CAPC2012X110]
C182  1uF  C_CHIP-0805(2012-METRIC)  [CAPC2012X110]
C183  0.1uF  C_CHIP-0805(2012-METRIC)  [CAPC2012X110]
C184  1uF  C_CHIP-0805(2012-METRIC)  [CAPC2012X110]
C185  0.1uF  C_CHIP-0805(2012-METRIC)  [CAPC2012X110]
C186  1uF  C_CHIP-0805(2012-METRIC)  [CAPC2012X110]
C187  0.1uF  C_CHIP-0805(2012-METRIC)  [CAPC2012X110]
C188  1uF  C_CHIP-0805(2012-METRIC)  [CAPC2012X110]
C189  0.1uF  C_CHIP-0805(2012-METRIC)  [CAPC2012X110]
C190  1uF  C_CHIP-0805(2012-METRIC)  [CAPC2012X110]
C191  0.1uF  C_CHIP-0805(2012-METRIC)  [CAPC2012X110]
C192  1uF  C_CHIP-0805(2012-METRIC)  [CAPC2012X110]
C193  0.1uF  C_CHIP-0805(2012-METRIC)  [CAPC2012X110]
C194  1uF  C_CHIP-0805(2012-METRIC)  [CAPC2012X110]
C195  0.1uF  C_CHIP-0805(2012-METRIC)  [CAPC2012X110]
C196  1uF  C_CHIP-0805(2012-METRIC)  [CAPC2012X110]
C197  0.1uF  C_CHIP-0805(2012-METRIC)  [CAPC2012X110]
C198  1uF  C_CHIP-0805(2012-METRIC)  [CAPC2012X110]
C199  0.1uF  C_CHIP-0805(2012-METRIC)  [CAPC2012X110]
C200  1uF  C_CHIP-0805(2012-METRIC)  [CAPC2012X110]
C201  0.1uF  C_CHIP-0805(2012-METRIC)  [CAPC2012X110]
C202  1uF  C_CHIP-0805(2012-METRIC)  [CAPC2012X110]
C203  0.1uF  C_CHIP-0805(2012-METRIC)  [CAPC2012X110]
C204  1uF  C_CHIP-0805(2012-METRIC)  [CAPC2012X110]
C205  0.1uF  C_CHIP-0805(2012-METRIC)  [CAPC2012X110]
C206  1uF  C_CHIP-0805(2012-METRIC)  [CAPC2012X110]
C207  0.1uF  C_CHIP-0805(2012-METRIC)  [CAPC2012X110]
C208  1uF  C_CHIP-0805(2012-METRIC)  [CAPC2012X110]
C209  0.1uF  C_CHIP-0805(2012-METRIC)  [CAPC2012X110]
C210  1uF  C_CHIP-0805(2012-METRIC)  [CAPC2012X110]
C211  0.1uF  C_CHIP-0805(2012-METRIC)  [CAPC2012X110]
C212  1uF  C_CHIP-0805(2012-METRIC)  [CAPC2012X110]
C213  0.1uF  C_CHIP-0805(2012-METRIC)  [CAPC2012X110]
C214  1uF  C_CHIP-0805(2012-METRIC)  [CAPC2012X110]
C215  0.1uF  C_CHIP-0805(2012-METRIC)  [CAPC2012X110]
C216  1uF  C_CHIP-0805(2012-METRIC)  [CAPC2012X110]
C217  0.1uF  C_CHIP-0805(2012-METRIC)  [CAPC2012X110]
C218  1uF  C_CHIP-0805(2012-METRIC)  [CAPC2012X110]
C219  0.1uF  C_CHIP-0805(2012-METRIC)  [CAPC2012X110]
C220  1uF  C_CHIP-0805(2012-METRIC)  [CAPC2012X110]
C221  0.1uF  C_CHIP-0805(2012-METRIC)  [CAPC2012X110]
C222  1uF  C_CHIP-0805(2012-METRIC)  [CAPC2012X110]
C223  0.1uF  C_CHIP-0805(2012-METRIC)  [CAPC2012X110]
C224  1uF  C_CHIP-0805(2012-METRIC)  [CAPC2012X110]
C225  0.1uF  C_CHIP-0805(2012-METRIC)  [CAPC2012X110]
C226  1uF  C_CHIP-0805(2012-METRIC)  [CAPC2012X110]
C227  0.1uF  C_CHIP-0805(2012-METRIC)  [CAPC2012X110]
C228  1uF  C_CHIP-0805(2012-METRIC)  [CAPC2012X110]
C229  0.1uF  C_CHIP-0805(2012-METRIC)  [CAPC2012X110]
C230  1uF  C_CHIP-0805(2012-METRIC)  [CAPC2012X110]
C231  0.1uF  C_CHIP-0805(2012-METRIC)  [CAPC2012X110]
C232  1uF  C_CHIP-0805(2012-METRIC)  [CAPC2012X110]
C233  0.1uF  C_CHIP-0805(2012-METRIC)  [CAPC2012X110]
C234  1uF  C_CHIP-0805(2012-METRIC)  [CAPC2012X110]
C235  0.1uF  C_CHIP-0805(2012-METRIC)  [CAPC2012X110]
C236  1uF  C_CHIP-0805(2012-METRIC)  [CAPC2012X110]
C237  0.1uF  C_CHIP-0805(2012-METRIC)  [CAPC2012X110]
C238  1uF  C_CHIP-0805(2012-METRIC)  [CAPC2012X110]
C239  0.1uF  C_CHIP-0805(2012-METRIC)  [CAPC2012X110]
C240  1uF  C_CHIP-0805(2012-METRIC)  [CAPC2012X110]
C241  0.1uF  C_CHIP-0805(2012-METRIC)  [CAPC2012X110]
C242  1uF  C_CHIP-0805(2012-METRIC)  [CAPC2012X110]
C243  0.1uF  C_CHIP-0805(2012-METRIC)  [CAPC2012X110]
C244  1uF  C_CHIP-0805(2012-METRIC)  [CAPC2012X110]
C245  0.1uF  C_CHIP-0805(2012-METRIC)  [CAPC2012X110]
C246  1uF  C_CHIP-0805(2012-METRIC)  [CAPC2012X110]
C247  0.1uF  C_CHIP-0805(2012-METRIC)  [CAPC2012X110]
C248  1uF  C_CHIP-0805(2012-METRIC)  [CAPC2012X110]
C250  0.1uF  C_CHIP-0805(2012-METRIC)  [CAPC2012X110]
C251  1uF  C_CHIP-0805(2012-METRIC)  [CAPC2012X110]
C252  0.1uF  C_CHIP-0805(2012-METRIC)  [CAPC2012X110]
C253  1uF  C_CHIP-0805(2012-METRIC)  [CAPC2012X110]
C254  0.1uF  C_CHIP-0805(2012-METRIC)  [CAPC2012X110]
C255  1uF  C_CHIP-0805(2012-METRIC)  [CAPC2012X110]
C256  0.1uF  C_CHIP-0805(2012-METRIC)  [CAPC2012X110]
C257  1uF  C_CHIP-0805(2012-METRIC)  [CAPC2012X110]
C258  0.1uF  C_CHIP-0805(2012-METRIC)  [CAPC2012X110]
C259  1uF  C_CHIP-0805(2012-METRIC)  [CAPC2012X110]
CR1  BAT85,113DO-34_NEX  [DO-34_NEX]
FB1  FERRITE_BEAD  FBCHIP-0603(1608-METRIC)  [BEADC1608X95N]
FB2  FERRITE_BEAD  FBCHIP-0603(1608-METRIC)  [BEADC1608X95N]
FB3  FERRITE_BEAD  FBCHIP-0603(1608-METRIC)  [BEADC1608X95N]
FB4  FERRITE_BEAD  FBCHIP-0603(1608-METRIC)  [BEADC1608X95N]
FB5  FERRITE_BEAD  FBCHIP-0603(1608-METRIC)  [BEADC1608X95N]
FB6  FERRITE_BEAD  FBCHIP-0603(1608-METRIC)  [BEADC1608X95N]
FB7  FERRITE_BEAD  FBCHIP-0603(1608-METRIC)  [BEADC1608X95N]
FB8  FERRITE_BEAD  FBCHIP-0603(1608-METRIC)  [BEADC1608X95N]
FB9  FERRITE_BEAD  FBCHIP-0603(1608-METRIC)  [BEADC1608X95N]
FB10  FERRITE_BEAD  FBCHIP-0603(1608-METRIC)  [BEADC1608X95N]
FB11  FERRITE_BEAD  FBCHIP-0603(1608-METRIC)  [BEADC1608X95N]
FB12  FERRITE_BEAD  FBCHIP-0603(1608-METRIC)  [BEADC1608X95N]
FB13  FERRITE_BEAD  FBCHIP-0603(1608-METRIC)  [BEADC1608X95N]
FB14  FERRITE_BEAD  FBCHIP-0603(1608-METRIC)  [BEADC1608X95N]
J1  3A/250V  B2B-XH-A  [B2B-XH-A]
JP1  PINHD-1X6/90  [1X06/90]
JP3  PINHD-2X3/90  [2X03/90]
JP4  PINHD-1X8/90  [1X08/90]
JP5  PINHD-1X6/90  [1X06/90]
JP6  PINHD-1X8/90  [1X08/90]
JP7  PINHD-1X7/90  [1X07/90]
JP9  PINHD-2X4/90  [2X04/90]
JP10  PINHD-1X4  [1X04]
JP11  PINHD-2X4/90  [2X04/90]
JP12  PINHD-1X1  [1X01]
JP13  PINHD-2X4/90  [2X04/90]
JP14  PINHD-2X4/90  [2X04/90]
JP15  PINHD-2X4/90  [2X04/90]
JP16  PINHD-2X3/90  [2X03/90]
JP17  PINHD-2X4/90  [2X04/90]
JP18  PINHD-2X3/90  [2X03/90]
JP19  PINHD-1X2/90  [1X02/90]
JP20  PINHD-1X2/90  [1X02/90]
JP21  PINHD-1X2/90  [1X02/90]
JP22  PINHD-1X2/90  [1X02/90]
JP23  PINHD-1X2/90  [1X02/90]
JP24  PINHD-1X2/90  [1X02/90]
R1  1k  R_CHIP-0603(1608-METRIC)  [RESC1608X60]
R2  470k  R_CHIP-0603(1608-METRIC)  [RESC1608X60]
R3  1M  R_CHIP-0603(1608-METRIC)  [RESC1608X60]
R4  1M  R_CHIP-0603(1608-METRIC)  [RESC1608X60]
R5  1M  R_CHIP-0603(1608-METRIC)  [RESC1608X60]
R6  1M  R_CHIP-0603(1608-METRIC)  [RESC1608X60]
R7  1M  R_CHIP-0603(1608-METRIC)  [RESC1608X60]
R8  1M  R_CHIP-0603(1608-METRIC)  [RESC1608X60]
R9  10k  R_CHIP-0603(1608-METRIC)  [RESC1608X60]
R10  1M  R_CHIP-0603(1608-METRIC)  [RESC1608X60]
RN1  CAY16-2201F4LF  [RESCAF80P320X160X60-8N]
RN2  CAY16-2201F4LF  [RESCAF80P320X160X60-8N]
RN3  CAY16-2201F4LF  [RESCAF80P320X160X60-8N]
RN4  CAY16-2201F4LF  [RESCAF80P320X160X60-8N]
RN5  CAY16-2201F4LF  [RESCAF80P320X160X60-8N]
RN6  CAY16-2201F4LF  [RESCAF80P320X160X60-8N]
RN7  CAY16-2201F4LF  [RESCAF80P320X160X60-8N]
RN8  CAY16-2201F4LF  [RESCAF80P320X160X60-8N]
RN9  CAY16-2201F4LF  [RESCAF80P320X160X60-8N]
RN10  CAY16-2201F4LF  [RESCAF80P320X160X60-8N]
RN11  CAY16-2201F4LF  [RESCAF80P320X160X60-8N]
RN12  CAY16-2201F4LF  [RESCAF80P320X160X60-8N]
RN13  CAY16-2201F4LF  [RESCAF80P320X160X60-8N]
S2  B3U-X000B3U3000P(M)-B3000P(M)-B  [B3U-3000P(M)-B]
TP1  TP  [1X01]
TP4  TP  [1X01]
TP5  TP  [1X01]
TP7  TP  [1X01]
TP8  TP  [1X01]
TP9  TP  [1X01]
TP10  TP  [1X01]
TP16  TP  [1X01]
TP18  TP  [1X01]
TP19  TP  [1X01]
TP20  TP  [1X01]
TP21  TP  [1X01]
TP22  TP  [1X01]
TP23  TP  [1X01]
TP24  TP  [1X01]
TP25  TP  [1X01]
TP26  TP  [1X01]
TP27  TP  [1X01]
TP28  TP  [1X01]
TP29  TP  [1X01]
TP30  TP  [1X01]
TPCS1  TP  [1X01]
TPCS2  TP  [1X01]
TPCS3  TP  [1X01]
TPCS4  TP  [1X01]
TPCS5  TP  [1X01]
TPCS6  TP  [1X01]
TPCS7  TP  [1X01]
TPCS8  TP  [1X01]
TPCS9  TP  [1X01]
TPRAW  TP  [1X01]
U1  ADS1194CPAG  [QFP50P1200X1200X120-64N]
U2  ADS1194CPAG  [QFP50P1200X1200X120-64N]
U3  ADS1194CPAG  [QFP50P1200X1200X120-64N]
U4  ADS1194CPAG  [QFP50P1200X1200X120-64N]
U5  ADS1194CPAG  [QFP50P1200X1200X120-64N]
U6  LM2664M6  [SOT95P280X145-6N]
U7  ADS1194CPAG  [QFP50P1200X1200X120-64N]
U8  PIC32MX250F128D-I_PT  [QFP44_10X10MC]
U9  MCP1754T-5002E/MC  [SON50P200X300X100-9N]
U10  TPS72325QDBVRQ1  [SOT95P280X145-5N]
U11  TLV70012QDCKRQ1  [SOT65P210X110-5N]
U13  TPD4E1B06DRLR  [SOT50P160X60-6N]
U14  TPD4E1B06DRLR  [SOT50P160X60-6N]
U15  TPD4E1B06DRLR  [SOT50P160X60-6N]
U16  TPD4E1B06DRLR  [SOT50P160X60-6N]
U17  TPD4E1B06DRLR  [SOT50P160X60-6N]
U18  TPD4E1B06DRLR  [SOT50P160X60-6N]
U19  TPD4E1B06DRLR  [SOT50P160X60-6N]
U20  TPD4E1B06DRLR  [SOT50P160X60-6N]
U21  TPD4E1B06DRLR  [SOT50P160X60-6N]
U22  TPD4E1B06DRLR  [SOT50P160X60-6N]
U23  TPD4E1B06DRLR  [SOT50P160X60-6N]
U24  TPD4E1B06DRLR  [SOT50P160X60-6N]
U25  TPD4E1B06DRLR  [SOT50P160X60-6N]
U26  LIS3DHHTRQFN_ICLX_STM  [QFN_ICLX_STM]
XTAL1  8M  CRYSTAL_HC49-11.5L  [XTALRR488W45L1150T500H350B]

## Nets
1N: JP17.7 RN1.3 U13.1(IO1)
1P: JP17.8 RN1.4 U13.3(IO2)
2N: JP17.5 RN1.1 U13.4(IO3)
2P: JP17.6 RN1.2 U13.6(IO4)
3N: JP17.3 RN2.3 U14.1(IO1)
3P: JP17.4 RN2.4 U14.3(IO2)
4N: JP17.1 RN2.1 U14.4(IO3)
4P: JP17.2 RN2.2 U14.6(IO4)
5N: JP18.5 RN3.3 U15.1(IO1)
5P: JP18.6 RN3.4 U15.3(IO2)
6N: JP18.3 RN3.1 U15.4(IO3)
6P: JP18.4 RN3.2 U15.6(IO4)
7N: JP18.1 RN4.3 U16.1(IO1)
7P: JP18.2 RN4.4 U16.3(IO2)
8N: JP9.7 RN4.1 U16.4(IO3)
8P: JP9.8 RN4.2 U16.6(IO4)
9N: JP15.7 RN5.3 U17.1(IO1)
9P: JP15.8 RN5.4 U17.3(IO2)
10N: JP15.5 RN5.1 U17.4(IO3)
10P: JP15.6 RN5.2 U17.6(IO4)
11N: JP15.3 RN6.3 U18.1(IO1)
11P: JP15.4 RN6.4 U18.3(IO2)
12N: JP15.1 RN6.1 U18.4(IO3)
12P: JP15.2 RN6.2 U18.6(IO4)
13N: JP16.5 RN7.3 U19.1(IO1)
13P: JP16.6 RN7.4 U19.3(IO2)
14N: JP16.3 RN7.1 U19.4(IO3)
14P: JP16.4 RN7.2 U19.6(IO4)
15N: JP16.1 RN8.3 U20.1(IO1)
15P: JP16.2 RN8.4 U20.3(IO2)
16N: JP11.7 RN8.1 U20.4(IO3)
16P: JP11.8 RN8.2 U20.6(IO4)
17N: JP14.7 RN9.3 U21.1(IO1)
17P: JP14.8 RN9.4 U21.3(IO2)
18N: JP14.5 RN9.1 U21.4(IO3)
18P: JP14.6 RN9.2 U21.6(IO4)
19N: JP14.3 RN10.3 U22.1(IO1)
19P: JP14.4 RN10.4 U22.3(IO2)
20N: JP14.1 RN10.1 U22.4(IO3)
20P: JP14.2 RN10.2 U22.6(IO4)
21N: JP3.5 RN11.3 U23.1(IO1)
21P: JP3.6 RN11.4 U23.3(IO2)
22N: JP3.3 RN11.1 U23.4(IO3)
22P: JP3.4 RN11.2 U23.6(IO4)
23N: JP3.1 RN12.3 U24.1(IO1)
23P: JP3.2 RN12.4 U24.3(IO2)
24N: JP13.7 RN12.1 U24.4(IO3)
24P: JP13.8 RN12.2 U24.6(IO4)
-RAW: C51.2 C89.1 U6.2(OUT) U10.1(IN) U10.2(EN)
AGND: C1.2 C6.2 C11.2 C12.2 C18.1 C19.2 C20.2 C27.2 C28.2 C35.1 C36.2 C37.2 C38.2 C44.2 C45.2 C51.1 C52.2 C53.2 C57.2 C58.2 C65.2 C66.2 C70.2 C71.2 C78.2 C79.2 C80.2 C87.2 C89.2 C90.2 C95.2 C96.2 C97.2 C98.2 C99.2 C100.2 C103.1 C103.2 C103.3 C103.4 C104.1 C104.2 C104.3 C104.4 C105.2 C106.1 C106.2 C106.3 C106.4 C107.1 C107.2 C107.3 C107.4 C108.1 C108.2 C108.3 C108.4 C109.1 C109.2 C109.3 C109.4 C110.1 C110.2 C110.3 C110.4 C112.1 C116.2 C118.2 C120.2 C123.2 C124.2 C125.2 C126.1 C126.2 C126.3 C126.4 C127.1 C127.2 C127.3 C127.4 C128.1 C128.2 C128.3 C128.4 C129.1 C129.2 C129.3 C129.4 C130.1 C130.2 C130.3 C130.4 C131.1 C131.2 C131.3 C131.4 C131.6 C131.7 C131.8 C132.2 C133.2 C134.2 C135.2 C137.2 C138.2 C139.2 C140.2 C141.2 C142.2 C143.2 C144.2 C145.2 C146.2 C147.2 C148.2 C149.2 C152.2 C155.2 C156.2 C157.2 C158.2 C159.2 C160.2 C161.2 C162.2 C163.2 C164.2 C165.2 C166.2 C169.2 C170.2 C171.2 C172.2 C173.2 C174.2 C175.2 C176.2 C177.2 C178.2 C179.2 C180.2 C181.2 C182.2 C183.2 C184.2 C185.2 C186.2 C187.2 C188.2 C189.2 C190.2 C191.2 C192.2 C193.2 C194.2 C195.2 C196.2 C197.2 C198.2 C199.2 C200.2 C201.2 C202.2 C203.2 C204.2 C205.2 C206.2 C207.2 C208.2 C209.2 C210.2 C211.2 C212.2 C213.2 C214.2 C215.2 C216.2 C217.2 C218.2 C219.2 C220.2 C221.2 C222.2 C223.2 C224.2 C225.2 C226.2 C227.2 C228.2 C229.2 C230.2 C231.2 C232.2 C233.2 C234.2 C235.2 C236.2 C237.2 C238.2 C239.2 C240.2 C241.2 C242.2 C243.2 C244.2 C245.2 C246.2 C247.2 C248.2 FB1.1 FB2.1 FB3.1 FB4.1 FB5.1 FB6.1 FB7.1 FB8.1 FB9.1 FB10.1 FB11.1 FB12.1 FB13.1 FB14.1 J1.2 JP5.4 JP7.3 JP9.3 JP9.4 JP11.3 JP11.4 JP13.3 JP13.4 RN13.2 RN13.3 RN13.4 RN13.5 RN13.6 RN13.7 TP18.1 TP19.1 TP20.1 TP21.1 U6.1(GND) U8.16(AVSS) U9.4(GND) U10.3(GND) U11.2(GND) U13.2(GND) U14.2(GND) U15.2(GND) U16.2(GND) U17.2(GND) U18.2(GND) U19.2(GND) U20.2(GND) U21.2(GND) U22.2(GND) U23.2(GND) U24.2(GND) U25.2(GND) U25.4(IO3)
AVDD: C1.1 C11.1 C12.1 C18.2 C27.1 C28.1 C44.1 C45.1 C57.1 C58.1 C70.1 C71.1 C100.1 C116.1 C120.1 C133.1 C134.1 C135.1 C137.1 C143.1 C144.1 C145.1 C146.1 C147.1 C148.1 C149.1 C159.1 C160.1 C161.1 C162.1 C163.1 C164.1 C165.1 C166.1 C209.1 C210.1 C211.1 C212.1 C213.1 C214.1 C215.1 C216.1 C217.1 C218.1 C219.1 C220.1 C221.1 C222.1 C223.1 C224.1 C225.1 C226.1 C227.1 C228.1 C229.1 C230.1 C231.1 C232.1 C233.1 C234.1 C235.1 C236.1 C237.1 C238.1 C239.1 C240.1 C241.1 C242.1 C243.1 C244.1 C245.1 C246.1 C247.1 C248.1 JP9.1 JP9.2 JP11.1 JP11.2 JP13.1 JP13.2 TP1.1 U1.1(IN8N) U1.2(IN8P) U1.3(IN7N) U1.4(IN7P) U1.5(IN6N) U1.6(IN6P) U1.7(IN5N) U1.8(IN5P) U1.19(AVDD) U1.21(AVDD) U1.22(AVDD) U1.54(AVDD1) U1.56(AVDD) U1.59(AVDD) U2.1(IN8N) U2.2(IN8P) U2.3(IN7N) U2.4(IN7P) U2.5(IN6N) U2.6(IN6P) U2.7(IN5N) U2.8(IN5P) U2.19(AVDD) U2.21(AVDD) U2.22(AVDD) U2.54(AVDD1) U2.56(AVDD) U2.59(AVDD) U3.1(IN8N) U3.2(IN8P) U3.3(IN7N) U3.4(IN7P) U3.5(IN6N) U3.6(IN6P) U3.7(IN5N) U3.8(IN5P) U3.19(AVDD) U3.21(AVDD) U3.22(AVDD) U3.54(AVDD1) U3.56(AVDD) U3.59(AVDD) U4.1(IN8N) U4.2(IN8P) U4.3(IN7N) U4.4(IN7P) U4.5(IN6N) U4.6(IN6P) U4.7(IN5N) U4.8(IN5P) U4.19(AVDD) U4.21(AVDD) U4.22(AVDD) U4.54(AVDD1) U4.56(AVDD) U4.59(AVDD) U5.1(IN8N) U5.2(IN8P) U5.3(IN7N) U5.4(IN7P) U5.5(IN6N) U5.6(IN6P) U5.7(IN5N) U5.8(IN5P) U5.19(AVDD) U5.21(AVDD) U5.22(AVDD) U5.54(AVDD1) U5.56(AVDD) U5.59(AVDD) U7.1(IN8N) U7.2(IN8P) U7.3(IN7N) U7.4(IN7P) U7.5(IN6N) U7.6(IN6P) U7.7(IN5N) U7.8(IN5P) U7.19(AVDD) U7.21(AVDD) U7.22(AVDD) U7.54(AVDD1) U7.56(AVDD) U7.59(AVDD) U11.5(OUT) U25.3(IO2)
AVSS: C2.1 C3.2 C5.2 C6.1 C7.2 C8.2 C10.2 C13.1 C14.2 C15.2 C16.2 C17.2 C19.1 C20.1 C25.2 C26.2 C29.1 C30.2 C31.2 C32.2 C33.2 C34.2 C35.2 C36.1 C37.1 C38.1 C42.2 C43.2 C46.1 C47.2 C48.2 C49.2 C50.2 C52.1 C53.1 C59.1 C60.2 C61.2 C62.2 C63.2 C65.1 C66.1 C68.2 C69.2 C72.1 C73.2 C74.2 C75.2 C76.2 C78.1 C79.1 C80.1 C84.2 C90.1 C94.2 C95.1 C96.1 C97.1 C99.1 C101.2 C102.2 C105.1 C118.1 C119.2 C121.2 C122.2 C123.1 C124.1 C125.1 C136.2 C138.1 C139.1 C140.1 C141.1 C142.1 C152.1 C153.2 C154.2 C155.1 C156.1 C157.1 C158.1 C169.1 C170.1 C171.1 C172.1 C173.1 C174.1 C175.1 C176.1 C177.1 C178.1 C179.1 C180.1 C181.1 C182.1 C183.1 C184.1 C185.1 C186.1 C187.1 C188.1 C189.1 C190.1 C191.1 C192.1 C193.1 C194.1 C195.1 C196.1 C197.1 C198.1 C199.1 C200.1 C201.1 C202.1 C203.1 C204.1 C205.1 C206.1 C207.1 C208.1 TP8.1 U1.20(AVSS) U1.23(AVSS) U1.25(VREFN) U1.32(AVSS) U1.53(AVSS1) U1.57(AVSS) U1.58(AVSS) U2.20(AVSS) U2.23(AVSS) U2.25(VREFN) U2.32(AVSS) U2.53(AVSS1) U2.57(AVSS) U2.58(AVSS) U3.20(AVSS) U3.23(AVSS) U3.25(VREFN) U3.32(AVSS) U3.53(AVSS1) U3.57(AVSS) U3.58(AVSS) U4.20(AVSS) U4.23(AVSS) U4.25(VREFN) U4.32(AVSS) U4.53(AVSS1) U4.57(AVSS) U4.58(AVSS) U5.20(AVSS) U5.23(AVSS) U5.25(VREFN) U5.32(AVSS) U5.53(AVSS1) U5.57(AVSS) U5.58(AVSS) U7.20(AVSS) U7.23(AVSS) U7.25(VREFN) U7.32(AVSS) U7.53(AVSS1) U7.57(AVSS) U7.58(AVSS) U10.4(OUT) U25.1(IO1)
BIAS: JP9.5 JP9.6 JP11.5 JP11.6 JP13.5 JP13.6 RN13.1 U25.6(IO4)
BIAS_ESD: C131.5 RN13.8 U1.60(RLDREF) U2.60(RLDREF) U3.60(RLDREF) U4.60(RLDREF) U5.60(RLDREF) U7.60(RLDREF)
BOOT_EN: R2.2 S2.1 U8.33(SOSCI/RPB4/RB4)
CLK: JP6.6 JP12.1 U1.37(CLK) U2.37(CLK) U3.37(CLK) U4.37(CLK) U5.37(CLK) U7.37(CLK)
CS1: TPCS1.1 U4.39(!CS) U8.15(AN9/C3INA/RPB15/SCK2/CTED6/PMCS1/RB15)
CS2: TPCS2.1 U7.39(!CS) U8.1(RPB9/SDA1/CTED4/PMD3/RB9)
CS3: TPCS3.1 U1.39(!CS) U8.44(RPB8/SCL1/CTED10/PMD4/RB8)
CS4: TPCS4.1 U2.39(!CS) U8.43(RPB7/CTED3/PMD5/INT0/RB7)
CS5: TPCS5.1 U3.39(!CS) U8.21(PGED1/AN2/C1IND/C2INB/C3IND/RPB0/PMD0/RB0)
CS6: TPCS6.1 U5.39(!CS) U8.22(PGEC1/AN3/C1INC/C2INA/RPB1/CTED12/PMD1/RB1)
CS7: TPCS7.1 U8.34(SOSCO/RPA4/T1CK/CTED9/RA4) U26.4(CS)
CS8: JP7.1 TPCS8.1 U8.35(TDI/RPA9/PMA9/RA9)
CS9: JP6.8 TPCS9.1 U8.38(RPC5/PMA3/RC5)
DGND: C4.2 C9.2 C21.2 C22.2 C23.2 C39.2 C40.2 C55.2 C56.2 C77.1 C81.2 C82.2 C85.2 C86.1 C88.2 C91.2 C92.2 C111.2 C113.2 C114.2 C115.2 C117.1 C150.2 C151.2 C167.2 C168.2 C250.2 C251.2 C252.2 C253.2 C254.2 C255.2 C256.2 C257.2 C258.2 C259.2 FB1.2 FB2.2 FB3.2 FB4.2 FB5.2 FB6.2 FB7.2 FB8.2 FB9.2 FB10.2 FB11.2 FB12.2 FB13.2 FB14.2 JP4.5 JP6.2 JP7.6 R2.1 TP22.1 TP23.1 TP24.1 TP25.1 TP26.1 TP27.1 TP28.1 TP29.1 U1.31(RESV1) U1.33(DGND) U1.41(DAISY_IN) U1.49(DGND) U1.51(DGND) U2.31(RESV1) U2.33(DGND) U2.41(DAISY_IN) U2.49(DGND) U2.51(DGND) U3.31(RESV1) U3.33(DGND) U3.41(DAISY_IN) U3.49(DGND) U3.51(DGND) U4.31(RESV1) U4.33(DGND) U4.41(DAISY_IN) U4.49(DGND) U4.51(DGND) U5.31(RESV1) U5.33(DGND) U5.41(DAISY_IN) U5.49(DGND) U5.51(DGND) U7.31(RESV1) U7.33(DGND) U7.41(DAISY_IN) U7.49(DGND) U7.51(DGND) U8.6(VSS_2) U8.29(VSS_3) U8.39(VSS) U26.9(GND_2) U26.10(GND_3) U26.11(GND_4) U26.12(GND_5) U26.13(GND_6) U26.14(GND_7) U26.15(GND_8) U26.16(GND)
DRDY1: U4.47(!DRDY) U8.19(PGED3/VREF+/CVREF+/AN0/C3INC/RPA0/CTED1/PMD7/RA0)
DRDY2: U7.47(!DRDY) U8.2(RPC6/PMA1/RC6)
DRDY3: U1.47(!DRDY) U8.3(RPC7/PMA0/RC7)
DRDY4: U2.47(!DRDY) U8.4(RPC8/PMA5/RC8)
DRDY5: U3.47(!DRDY) U8.5(RPC9/CTED7/PMA6/RC9)
DRDY6: U5.47(!DRDY) U8.23(AN4/C1INB/C2IND/RPB2/SDA2/CTED13/PMD2/CNB2/RB2)
DVDD: C4.1 C9.1 C21.1 C22.1 C23.1 C39.1 C40.1 C55.1 C56.1 C77.2 C81.1 C82.1 C86.2 C88.1 C91.1 C92.1 C112.2 C113.1 C117.2 C132.1 C150.1 C151.1 C167.1 C168.1 C250.1 C251.1 C252.1 C253.1 C254.1 C255.1 C256.1 C257.1 C258.1 C259.1 JP4.4 JP6.1 JP7.4 R9.2 S2.2 TP4.1 U1.48(DVDD) U1.50(DVDD) U1.52(CLKSEL) U2.48(DVDD) U2.50(DVDD) U2.52(CLKSEL) U3.48(DVDD) U3.50(DVDD) U3.52(CLKSEL) U4.48(DVDD) U4.50(DVDD) U4.52(CLKSEL) U5.48(DVDD) U5.50(DVDD) U5.52(CLKSEL) U6.4(!SD) U6.5(V+) U7.48(DVDD) U7.50(DVDD) U7.52(CLKSEL) U8.10(VUSB3V3) U8.17(AVDD) U8.28(VDD_2) U8.40(VDD) U9.1(VOUT) U11.1(IN) U11.3(EN) U26.7(VDDIO) U26.8(VDD)
EN: JP5.6 U8.26(AN7/RPC1/RC1)
IN1N: C103.7 RN1.6 U4.15(IN1N)
IN1P: C103.8 RN1.5 U4.16(IN1P)
IN2N: C103.5 RN1.8 U4.13(IN2N)
IN2P: C103.6 RN1.7 U4.14(IN2P)
IN3N: C104.7 RN2.6 U4.11(IN3N)
IN3P: C104.8 RN2.5 U4.12(IN3P)
IN4N: C104.5 RN2.8 U4.9(IN4N)
IN4P: C104.6 RN2.7 U4.10(IN4P)
IN5N: C106.7 RN3.6 U7.15(IN1N)
IN5P: C106.8 RN3.5 U7.16(IN1P)
IN6N: C106.5 RN3.8 U7.13(IN2N)
IN6P: C106.6 RN3.7 U7.14(IN2P)
IN7N: C107.7 RN4.6 U7.11(IN3N)
IN7P: C107.8 RN4.5 U7.12(IN3P)
IN8N: C107.5 RN4.8 U7.9(IN4N)
IN8P: C107.6 RN4.7 U7.10(IN4P)
IN9N: C108.6 RN5.6 U1.15(IN1N)
IN9P: C108.5 RN5.5 U1.16(IN1P)
IN10N: C108.8 RN5.8 U1.13(IN2N)
IN10P: C108.7 RN5.7 U1.14(IN2P)
IN11N: C109.6 RN6.6 U1.11(IN3N)
IN11P: C109.5 RN6.5 U1.12(IN3P)
IN12N: C109.8 RN6.8 U1.9(IN4N)
IN12P: C109.7 RN6.7 U1.10(IN4P)
IN13N: C110.6 RN7.6 U2.15(IN1N)
IN13P: C110.5 RN7.5 U2.16(IN1P)
IN14N: C110.8 RN7.8 U2.13(IN2N)
IN14P: C110.7 RN7.7 U2.14(IN2P)
IN15N: C126.6 RN8.6 U2.11(IN3N)
IN15P: C126.5 RN8.5 U2.12(IN3P)
IN16N: C126.8 RN8.8 U2.9(IN4N)
IN16P: C126.7 RN8.7 U2.10(IN4P)
IN17N: C127.6 RN9.6 U3.15(IN1N)
IN17P: C127.5 RN9.5 U3.16(IN1P)
IN18N: C127.8 RN9.8 U3.13(IN2N)
IN18P: C127.7 RN9.7 U3.14(IN2P)
IN19N: C128.6 RN10.6 U3.11(IN3N)
IN19P: C128.5 RN10.5 U3.12(IN3P)
IN20N: C128.8 RN10.8 U3.9(IN4N)
IN20P: C128.7 RN10.7 U3.10(IN4P)
IN21N: C129.6 RN11.6 U5.15(IN1N)
IN21P: C129.5 RN11.5 U5.16(IN1P)
IN22N: C129.8 RN11.8 U5.13(IN2N)
IN22P: C129.7 RN11.7 U5.14(IN2P)
IN23N: C130.6 RN12.6 U5.11(IN3N)
IN23P: C130.5 RN12.5 U5.12(IN3P)
IN24N: C130.8 RN12.8 U5.9(IN4N)
IN24P: C130.7 RN12.7 U5.10(IN4P)
INT1: U8.41(RPB5/USBID/RB5) U26.6(INT1)
MCLR': JP4.1 R1.1 U8.18(*MCLR)
MISO: JP6.3 JP7.7 TP9.1 TP10.1 U1.43(DOUT) U2.43(DOUT) U3.43(DOUT) U4.43(DOUT) U5.43(DOUT) U7.43(DOUT) U8.9(PGEC2/RPB11/D-/RB11) U26.3(SDO)
MOSI: JP6.7 JP7.2 TP5.1 TP7.1 TP16.1 U1.34(DIN) U2.34(DIN) U3.34(DIN) U4.34(DIN) U5.34(DIN) U7.34(DIN) U8.20(PGEC3/VREF-/CVREF-/AN1/RPA1/CTED2/PMD6/RA1) U26.2(SDI)
N$2: C119.1 U4.26(VCAP4)
N$3: C3.1 C8.1 U4.55(VCAP3)
N$4: C121.1 U4.30(VCAP2)
N$5: C101.1 U4.28(VCAP1)
N$7: C15.1 C16.1 U7.55(VCAP3)
N$8: C17.1 U7.30(VCAP2)
N$9: C154.1 U7.28(VCAP1)
N$10: CR1.2 J1.1
N$12: C31.1 C32.1 U1.55(VCAP3)
N$13: C34.1 U1.30(VCAP2)
N$14: C102.1 U1.28(VCAP1)
N$17: C48.1 C49.1 U2.55(VCAP3)
N$18: C50.1 U2.30(VCAP2)
N$19: C153.1 U2.28(VCAP1)
N$22: C61.1 C62.1 U3.55(VCAP3)
N$23: C63.1 U3.30(VCAP2)
N$24: C122.1 U3.28(VCAP1)
N$25: C42.1 U1.64(WCT)
N$27: C74.1 C75.1 U5.55(VCAP3)
N$28: C76.1 U5.30(VCAP2)
N$29: C136.1 U5.28(VCAP1)
N$31: C98.1 U10.5(NR)
N$32: C64.2 U6.6(CAP+)
N$33: C64.1 U6.3(CAP-)
N$35: C115.1 R10.1 U8.30(OSC1/CLKI/RPA2/RA2) XTAL1.1
N$36: C2.2 C5.1 U4.24(VREFP)
N$37: C114.1 R10.2 U8.31(OSC2/CLKO/RPA3/RA3) XTAL1.2
N$38: C111.1 R1.2 R9.1
N$39: C85.1 U8.7(VCAP)
N$40: C25.1 U7.64(WCT)
N$41: C10.1 U7.26(VCAP4)
N$42: C26.1 U1.26(VCAP4)
N$43: C68.1 U2.64(WCT)
N$44: C43.1 U2.26(VCAP4)
N$45: C84.1 U5.64(WCT)
N$47: C69.1 U5.26(VCAP4)
N$48: C13.2 C14.1 U7.24(VREFP)
N$49: C94.1 U3.64(WCT)
N$51: C33.1 U3.26(VCAP4)
N$52: C46.2 C47.1 U2.24(VREFP)
N$53: C72.2 C73.1 U5.24(VREFP)
N$54: C59.2 C60.1 U3.24(VREFP)
N$55: C29.2 C30.1 U1.24(VREFP)
N$61: C7.1 U4.64(WCT)
PGEC: JP4.2 U8.13(PGEC/TCK/CTED8/PMA7/RA7)
PGED: JP4.3 U8.12(PGED/TMS/PMA10/RA10)
RAW: C87.1 CR1.1 JP5.5 TPRAW.1 U9.5(SHDN') U9.8(VIN)
RESET: JP6.5 U1.36(!RESET) U2.36(!RESET) U3.36(!RESET) U4.36(!RESET) U5.36(!RESET) U7.36(!RESET) U8.8(PGED2/RPB10/D+/CTED11/RB10)
RLDIN1: JP19.1 U4.62(RLDIN)
RLDIN2: JP20.1 U7.62(RLDIN)
RLDIN3: JP21.1 U1.62(RLDIN)
RLDIN4: JP22.1 U2.62(RLDIN)
RLDIN5: JP23.1 U3.62(RLDIN)
RLDIN6: JP24.1 U5.62(RLDIN)
RLDINV1: C54.2 JP1.1 R3.1 U4.61(RLDINV)
RLDINV2: C24.2 JP1.2 R4.1 U7.61(RLDINV)
RLDINV3: C41.2 JP1.3 R5.1 U1.61(RLDINV)
RLDINV4: C67.2 JP1.4 R8.1 U2.61(RLDINV)
RLDINV5: C93.2 JP1.5 R6.1 U3.61(RLDINV)
RLDINV6: C83.2 JP1.6 R7.1 U5.61(RLDINV)
RLDOUT1: C54.1 JP19.2 R3.2 U4.63(RLDOUT)
RLDOUT2: C24.1 JP20.2 R4.2 U7.63(RLDOUT)
RLDOUT3: C41.1 JP21.2 R5.2 U1.63(RLDOUT)
RLDOUT4: C67.1 JP22.2 R8.2 U2.63(RLDOUT)
RLDOUT5: C93.1 JP23.2 R6.2 U3.63(RLDOUT)
RLDOUT6: C83.1 JP24.2 R7.2 U5.63(RLDOUT)
RPA8: JP10.1 U8.32(TDO/RPA8/PMA8/RA8)
RPC2: JP10.2 U8.27(AN8/RPC2/PMA2/RC2)
RPC3: JP10.3 U8.36(AN12/RPC3/RC3)
RPC4: JP10.4 U8.37(RPC4/PMA4/RC4)
RXD: JP5.2 U8.11(AN11/RPB13/CTPLS/PMRD/RB13)
SCLK: JP6.4 JP7.5 TP30.1 U1.40(SCLK) U2.40(SCLK) U3.40(SCLK) U4.40(SCLK) U5.40(SCLK) U7.40(SCLK) U8.14(CVREF/AN10/C3INB/RPB14/VBUSON/SCK1/CTED5/RB14) U26.1(SPC)
START: U1.38(START) U2.38(START) U3.38(START) U4.38(START) U5.38(START) U7.38(START) U8.25(AN6/RPC0/RC0)
STATE: JP5.1
TXD: JP5.3 U8.24(AN5/C1INA/C2INC/RTCC/RPB3/SCL2/PMWR/CNB3/RB3)
Unconnected: JP4.6 JP4.7 JP4.8 U1.17(TESTP_PACE_OUT1) U1.18(TESTN_PACE_OUT2) U1.35(!PWDN) U1.42(GPIO1) U1.44(GPIO2) U1.45(GPIO3) U1.46(GPIO4) U2.17(TESTP_PACE_OUT1) U2.18(TESTN_PACE_OUT2) U2.35(!PWDN) U2.42(GPIO1) U2.44(GPIO2) U2.45(GPIO3) U2.46(GPIO4) U3.17(TESTP_PACE_OUT1) U3.18(TESTN_PACE_OUT2) U3.35(!PWDN) U3.42(GPIO1) U3.44(GPIO2) U3.45(GPIO3) U3.46(GPIO4) U4.17(TESTP_PACE_OUT1) U4.18(TESTN_PACE_OUT2) U4.35(!PWDN) U4.42(GPIO1) U4.44(GPIO2) U4.45(GPIO3) U4.46(GPIO4) U5.17(TESTP_PACE_OUT1) U5.18(TESTN_PACE_OUT2) U5.35(!PWDN) U5.42(GPIO1) U5.44(GPIO2) U5.45(GPIO3) U5.46(GPIO4) U7.17(TESTP_PACE_OUT1) U7.18(TESTN_PACE_OUT2) U7.35(!PWDN) U7.42(GPIO1) U7.44(GPIO2) U7.45(GPIO3) U7.46(GPIO4) U9.2(PWRGD) U9.3(NC) U9.6(NC) U9.7(NC) U11.4(NC) U26.5(INT2)

## Power pins joined to a net without a drawn wire
VBUS: U8.42(VBUS)

## Library data of the parts
C1-C4 C6-C13 C15-C17 C19-C29 C31-C34 C36-C46 C48-C50 C52-C59 C61-C63 C65-C72 C74-C76 C78-C84 C87-C102 C105 C111-C125 C132-C248 C250-C259 = Capacitor:C: Capacitor - Generic; CATEGORY: Capacitor
C5 C14 C18 C30 C35 C47 C51 C60 C64 C73 C77 C85 C86 = 293D106X0016A2TE3:293D106X0016A2TE3; COPYRIGHT: Copyright (C) 2023 Ultra Librarian. All rights reserved.; MANUFACTURER_PART_NUMBER: 293D106X0016A2TE3; MFR_NAME: Vishay
C103 C104 C106-C110 C126-C131 = CKCL44X7R1H102M085AA:CKCL44X7R1H102M085AA; COPYRIGHT: Copyright (C) 2023 Ultra Librarian. All rights reserved.; MANUFACTURER_PART_NUMBER: CKCL44X7R1H102M085AA; MFR_NAME: TDK
CR1 = bat85:BAT85,113; COPYRIGHT: Copyright (C) 2023 Ultra Librarian. All rights reserved.; MANUFACTURER_PART_NUMBER: BAT85,113; MFR_NAME: Nexperia
FB1-FB14 = Filter:FB: Ferrite Bead - Generic; CATEGORY: Filter; SUB-CATEGORY: Ferrite bead
J1 = Connector:B2B-XH-A: XH Connector Top Entry - 2POS Details see: Datasheet <http://www.jst-mfg.com/product/pdf/eng/eXH.pdf>; CATEGORY: CONNECTOR; DESCRIPTION: 2.5mm pitch/disconnectable crimp style connector; MANUFACTURER: JST (XH CONNECTOR); MPN: B2B-XH-A; OPERATING_TEMPERATURE: -25°C ~ 85°C; PART_STATUS: ACTIVE; ROHS_COMPLIANT: COMPLIANT; SERIES: B_B-XH-A; SUB_CATEGORY: Through hole connector; TYPE: top entry
JP1 JP5 = Connector:PINHD-1X6: PIN HEADER; CATEGORY: CONNECTOR; SUB-CATEGORY: PIN-HEADER
JP3 JP16 JP18 = Connector:PINHD-2X3: PIN HEADER; CATEGORY: CONNECTOR; SUB-CATEGORY: PIN-HEADER
JP4 JP6 = Connector:PINHD-1X8: PIN HEADER; CATEGORY: CONNECTOR; SUB-CATEGORY: PIN-HEADER
JP7 = Connector:PINHD-1X7: PIN HEADER; CATEGORY: CONNECTOR; SUB-CATEGORY: PIN-HEADER
JP9 JP11 JP13-JP15 JP17 = Connector:PINHD-2X4: PIN HEADER; CATEGORY: CONNECTOR; SUB-CATEGORY: PIN-HEADER
JP10 = Connector:PINHD-1X4: PIN HEADER; CATEGORY: CONNECTOR; SUB-CATEGORY: PIN-HEADER
JP12 = Connector:PINHD-1X1: PIN HEADER; CATEGORY: CONNECTOR; SUB-CATEGORY: PIN-HEADER
JP19-JP24 = Connector:PINHD-1X2: PIN HEADER; CATEGORY: CONNECTOR; SUB-CATEGORY: PIN-HEADER
R1-R10 = Resistor:R: Resistor Fixed - Generic; CATEGORY: Resistor; SUB-CATEGORY: Fixed
RN1-RN13 = CAY16-2201F4LF (1):CAY16-2201F4LF: Res Thick Film Array 75 Ohm 5% 0.25W(1/4W) ?200ppm/C ISOL Molded 8-Pin 1206(4 X 0603) Convex SMD T/R; MANUFACTURER: Bourns; STANDARD: IPC-7351B
S2 = Switch:B3U-X000: Ultra-small Tactile Switch Contact form : SPST-NO Datasheet <https://omronfs.omron.com/en_US/ecb/products/pdf/en-b3u.pdf>; CATEGORY: SWITCH; DESCRIPTION: Ultra-small Surface-mounting Tactile Switches with High Contact Reliability; MANUFACTURER: OMRON; OPERATING_TEMPERATURE: -25°C to +70°C; PART_STATUS: ACTIVE; ROHS_COMPLIANCE: RoHS Compliant; SERIES: B3U; TYPE: Tactile; VALUE: B3U-3000P(M)-B
TP1 TP4 TP5 TP7-TP10 TP16 TP18-TP30 TPCS1-TPCS9 TPRAW = BASIC_Components:TP
U1-U5 U7 = ADS1194CPAG:ADS1194CPAG
U6 = LM2664M6:LM2664M6
U8 = PIC32MX250F128D-I_PT:PIC32MX250F128D-I_PT
U9 = MCP1754T-5002E_MC:MCP1754T-5002E/MC: None; MANUFACTURER: Microchip; PACKAGE: SON50P200X300X100-9N
U10 = TPS72325QDBVRQ1:TPS72325QDBVRQ1: None; MANUFACTURER: Texas Instruments; PACKAGE: SOT95P280X145-5N
U11 = TLV70012QDCKRQ1:TLV70012QDCKRQ1: None; MANUFACTURER: Texas Instruments; PACKAGE: SOT65P210X110-5N
U13-U25 = TPD4E1B06DRLR:TPD4E1B06DRLR
U26 = LIS3DHHTR:LIS3DHHTR; COPYRIGHT: Copyright (C) 2023 Ultra Librarian. All rights reserved.; MANUFACTURER_PART_NUMBER: LIS3DHHTR; MFR_NAME: STMicroelectronics
XTAL1 = Frequency-Source:CRYSTAL: Crystal 2Pin - Generic; CATEGORY: Frequency-Source; SUB-CATEGORY: Crystal-2Pin; VALUE: HC49